# Altium project Gen_Ai_Kbd.PrjPcb (part 1 of 3)
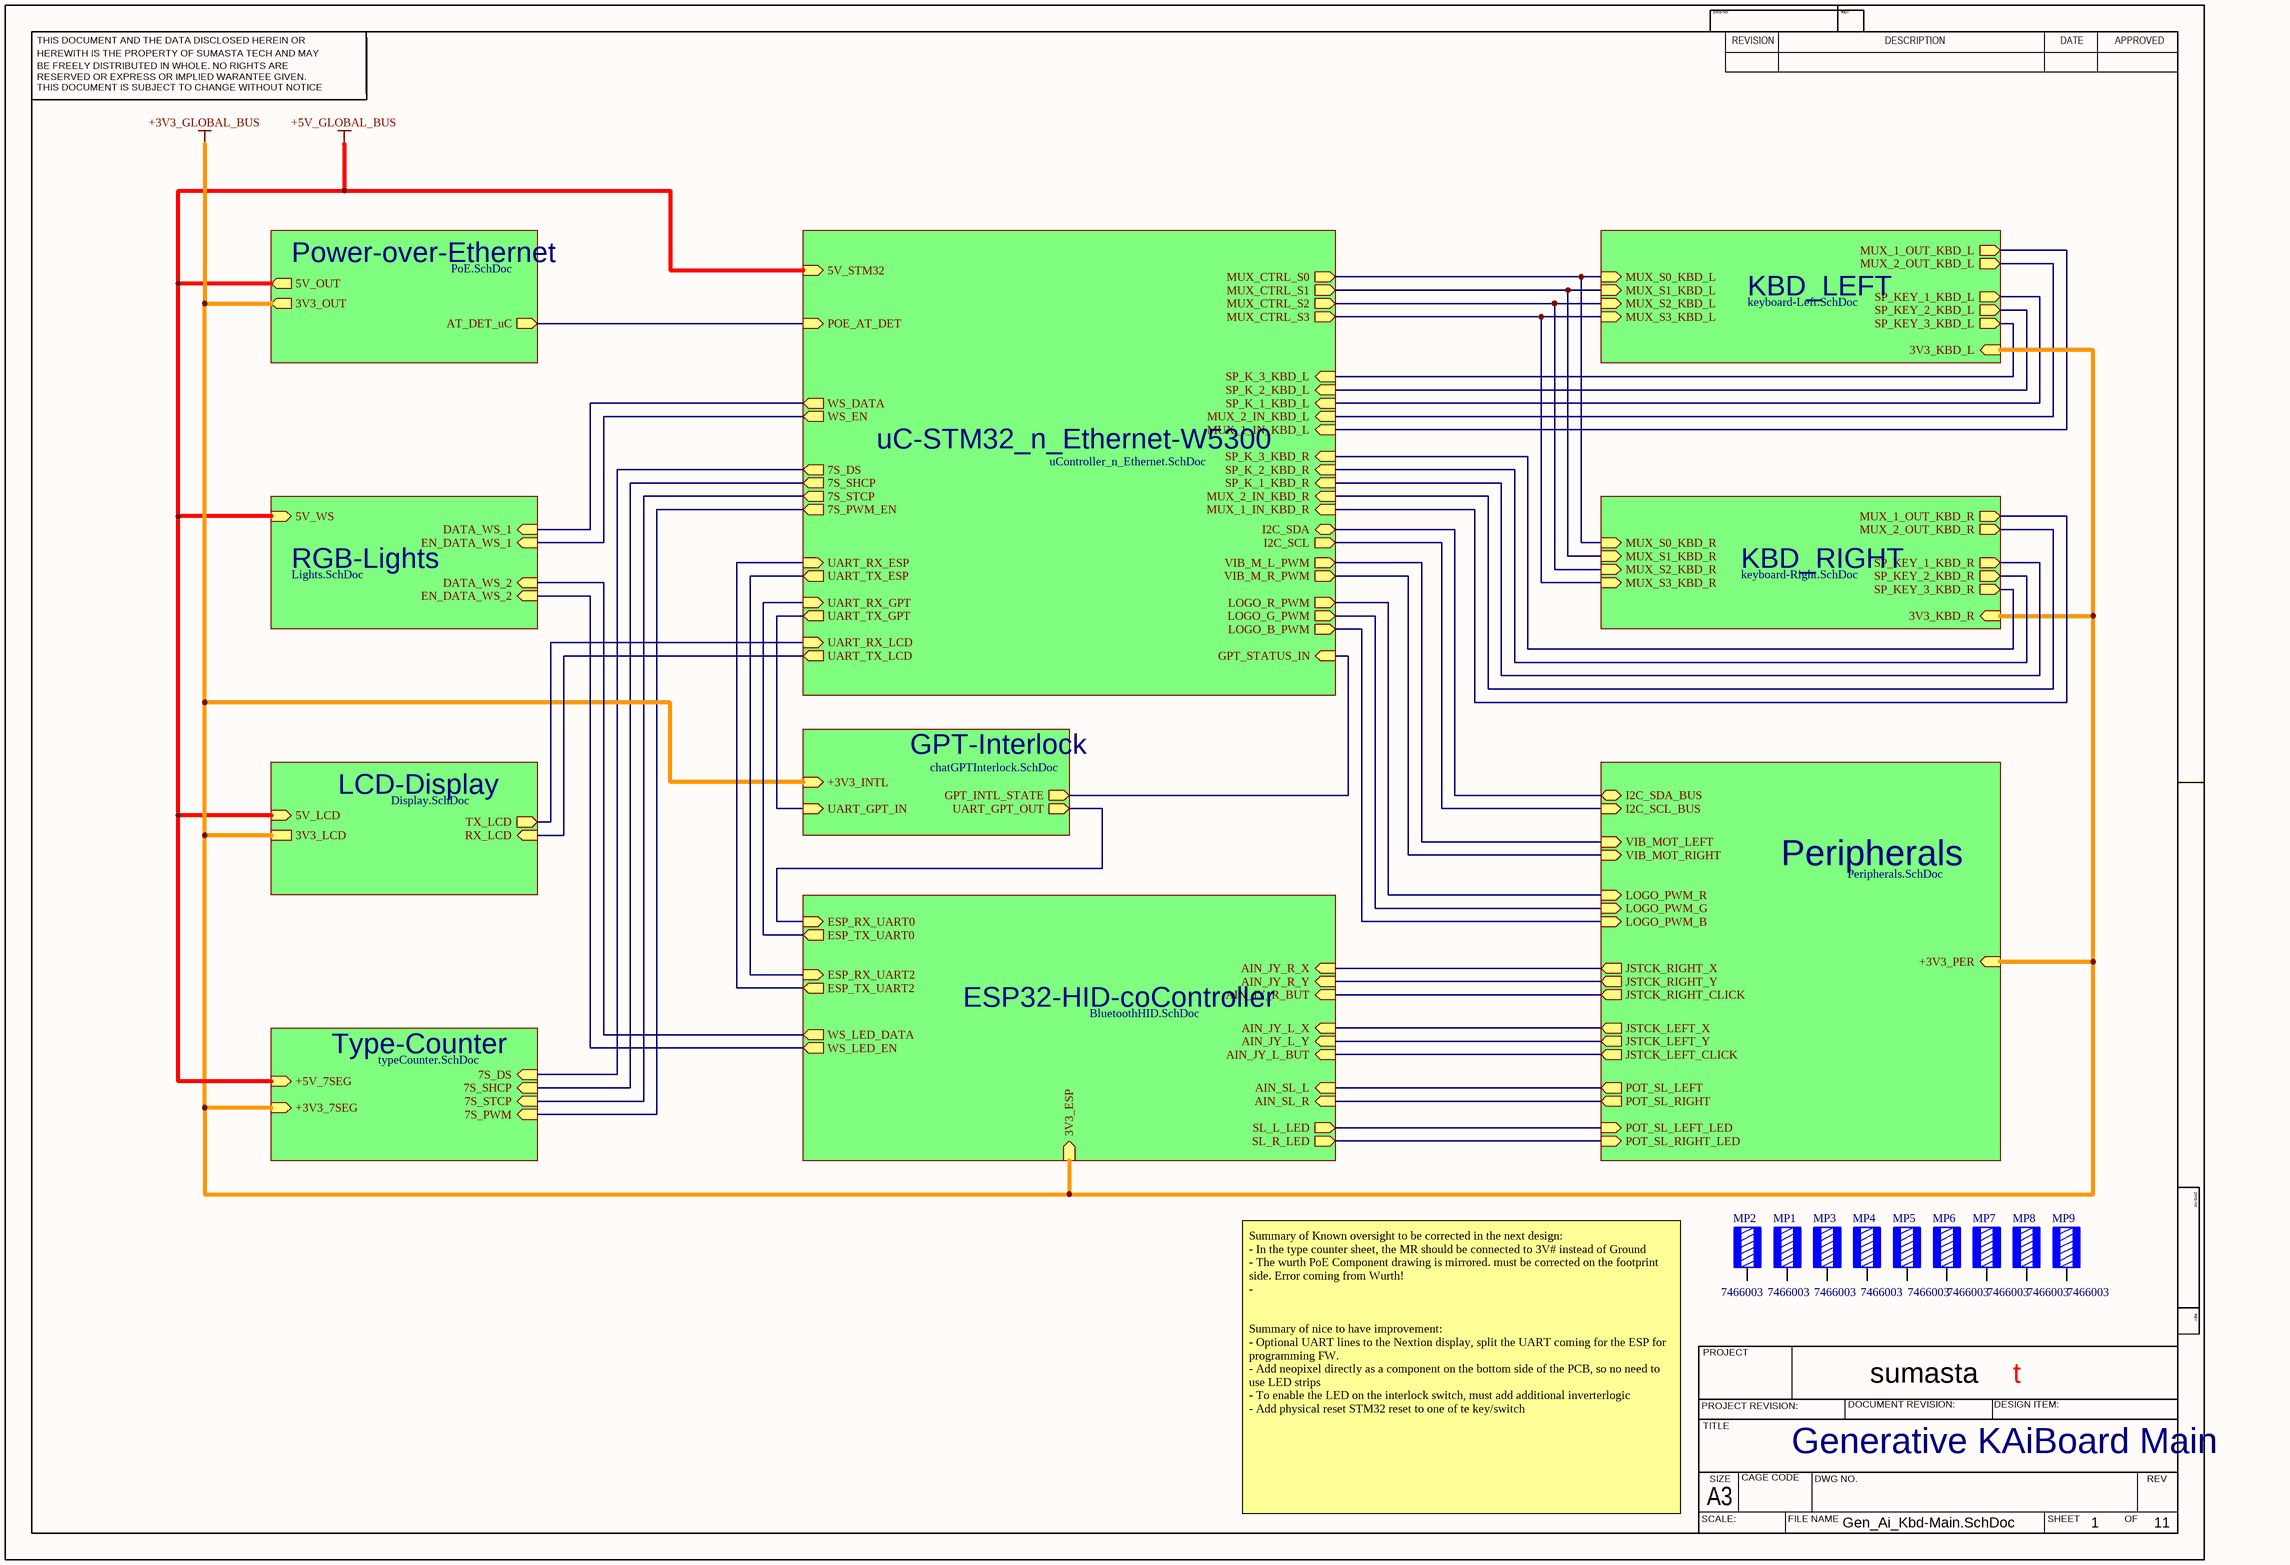
[diagram p0: Gen_Ai_Kbd-Main.SchDoc]
=CAGE: Test; =DOC_NO_BOM: Default
11 sheets, 428 parts. Net scope: hierarchical (ports join the sheet entries above them; power ports are global).
Board file: Gen_Ai_Kbd.PcbDoc
Sheets:
  Gen_Ai_Kbd-Main.SchDoc
    KBD_LEFT = keyboard-Left.SchDoc
    KBD_RIGHT = keyboard-Right.SchDoc
    Power-over-Ethernet = PoE.SchDoc
    RGB-Lights = Lights.SchDoc
    LCD-Display = Display.SchDoc
    Peripherals = Peripherals.SchDoc
    uC-STM32_n_Ethernet-W5300 = uController_n_Ethernet.SchDoc
    ESP32-HID-coController = BluetoothHID.SchDoc
    Type-Counter = typeCounter.SchDoc
    GPT-Interlock = chatGPTInterlock.SchDoc

## Sheet Gen_Ai_Kbd-Main.SchDoc
size 420 x 297 mm; SheetNumber: 1; SheetTotal: 11

### Parts
MP1  7466003  [7466003]
MP2  7466003  [7466003]
MP3  7466003  [7466003]
MP4  7466003  [7466003]
MP5  7466003  [7466003]
MP6  7466003  [7466003]
MP7  7466003  [7466003]
MP8  7466003  [7466003]
MP9  7466003  [7466003]

### Sub-sheets
ESP32-HID-coController = BluetoothHID.SchDoc: 3V3_ESP (in), AIN_JY_L_X (in), AIN_JY_L_Y (in), AIN_JY_R_X (in), AIN_JY_R_Y (in), AIN_SL_R (in), AIN_SL_L (in), AIN_JY_L_BUT (in), AIN_JY_R_BUT (in), ESP_RX_UART2 (in), ESP_TX_UART2 (out), SL_R_LED (out), SL_L_LED (out), ESP_RX_UART0 (in), ESP_TX_UART0 (out), WS_LED_DATA (out), WS_LED_EN (out)
GPT-Interlock = chatGPTInterlock.SchDoc: +3V3_INTL (in), UART_GPT_IN (in), UART_GPT_OUT (out), GPT_INTL_STATE (out)
KBD_LEFT = keyboard-Left.SchDoc: MUX_S0_KBD_L (in), MUX_S1_KBD_L (in), MUX_S2_KBD_L (in), MUX_S3_KBD_L (in), 3V3_KBD_L (in), MUX_1_OUT_KBD_L (out), MUX_2_OUT_KBD_L (out), SP_KEY_1_KBD_L (out), SP_KEY_2_KBD_L (out), SP_KEY_3_KBD_L (out)
KBD_RIGHT = keyboard-Right.SchDoc: MUX_S0_KBD_R (in), MUX_S1_KBD_R (in), MUX_S2_KBD_R (in), MUX_S3_KBD_R (in), 3V3_KBD_R (in), MUX_1_OUT_KBD_R (out), MUX_2_OUT_KBD_R (out), SP_KEY_1_KBD_R (out), SP_KEY_2_KBD_R (out), SP_KEY_3_KBD_R (out)
LCD-Display = Display.SchDoc: 5V_LCD (in), TX_LCD (out), RX_LCD (in), 3V3_LCD
Peripherals = Peripherals.SchDoc: +3V3_PER (in), JSTCK_LEFT_X (out), JSTCK_LEFT_Y (out), JSTCK_LEFT_CLICK (out), JSTCK_RIGHT_X (out), JSTCK_RIGHT_Y (out), JSTCK_RIGHT_CLICK (out), LOGO_PWM_R (in), LOGO_PWM_G (in), LOGO_PWM_B (in), I2C_SDA_BUS (bidir), I2C_SCL_BUS (in), POT_SL_LEFT (out), POT_SL_RIGHT (out), POT_SL_LEFT_LED (in), POT_SL_RIGHT_LED (in), VIB_MOT_LEFT (in), VIB_MOT_RIGHT (in)
Power-over-Ethernet = PoE.SchDoc: AT_DET_uC (out), 5V_OUT (out), 3V3_OUT (out)
RGB-Lights = Lights.SchDoc: 5V_WS (in), DATA_WS_1 (in), DATA_WS_2 (in), EN_DATA_WS_1 (in), EN_DATA_WS_2 (in)
Type-Counter = typeCounter.SchDoc: +5V_7SEG (in), +3V3_7SEG (in), 7S_DS (in), 7S_SHCP (in), 7S_STCP (in), 7S_PWM (in)
uC-STM32_n_Ethernet-W5300 = uController_n_Ethernet.SchDoc: I2C_SCL (out), I2C_SDA (bidir), LOGO_R_PWM (out), LOGO_G_PWM (out), LOGO_B_PWM (out), VIB_M_L_PWM (out), VIB_M_R_PWM (out), MUX_1_IN_KBD_R (in), MUX_CTRL_S0 (out), MUX_CTRL_S1 (out), MUX_CTRL_S2 (out), MUX_CTRL_S3 (out), SP_K_1_KBD_L (in), SP_K_2_KBD_L (in), SP_K_3_KBD_L (in), SP_K_1_KBD_R (in), SP_K_2_KBD_R (in), SP_K_3_KBD_R (in), 7S_DS (out), 7S_SHCP (out), 7S_STCP (out), 7S_PWM_EN (out), POE_AT_DET (in), UART_TX_LCD (out), UART_RX_LCD (in), UART_RX_GPT (in), UART_TX_GPT (out), UART_TX_ESP (out), UART_RX_ESP (in), WS_DATA (out), WS_EN (out), 5V_STM32 (in), GPT_STATUS_IN (in), MUX_2_IN_KBD_L (in), MUX_1_IN_KBD_L (in), MUX_2_IN_KBD_R (in)

### Nets
+3V3_GLOBAL_BUS: sheet KBD_LEFT/3V3_KBD_L, sheet KBD_RIGHT/3V3_KBD_R, sheet Power-over-Ethernet/3V3_OUT, sheet LCD-Display/3V3_LCD, sheet Peripherals/+3V3_PER, sheet ESP32-HID-coController/3V3_ESP, sheet Type-Counter/+3V3_7SEG, sheet GPT-Interlock/+3V3_INTL
+5V_GLOBAL_BUS: sheet Power-over-Ethernet/5V_OUT, sheet RGB-Lights/5V_WS, sheet LCD-Display/5V_LCD, sheet uC-STM32_n_Ethernet-W5300/5V_STM32, sheet Type-Counter/+5V_7SEG
I2C1_SCL: sheet Peripherals/I2C_SCL_BUS, sheet uC-STM32_n_Ethernet-W5300/I2C_SCL
I2C1_SDA: sheet Peripherals/I2C_SDA_BUS, sheet uC-STM32_n_Ethernet-W5300/I2C_SDA
PA0: sheet Peripherals/LOGO_PWM_R, sheet uC-STM32_n_Ethernet-W5300/LOGO_R_PWM
PA1: sheet Peripherals/LOGO_PWM_G, sheet uC-STM32_n_Ethernet-W5300/LOGO_G_PWM
PA2: sheet uC-STM32_n_Ethernet-W5300/UART_TX_ESP, sheet ESP32-HID-coController/ESP_RX_UART2
PA3: sheet uC-STM32_n_Ethernet-W5300/UART_RX_ESP, sheet ESP32-HID-coController/ESP_TX_UART2
PA4: sheet uC-STM32_n_Ethernet-W5300/GPT_STATUS_IN, sheet GPT-Interlock/GPT_INTL_STATE
PA15: sheet Peripherals/LOGO_PWM_B, sheet uC-STM32_n_Ethernet-W5300/LOGO_B_PWM
PB0: sheet uC-STM32_n_Ethernet-W5300/7S_PWM_EN, sheet Type-Counter/7S_PWM
PB1: sheet KBD_LEFT/SP_KEY_1_KBD_L, sheet uC-STM32_n_Ethernet-W5300/SP_K_1_KBD_L
PB2: sheet KBD_LEFT/SP_KEY_3_KBD_L, sheet uC-STM32_n_Ethernet-W5300/SP_K_3_KBD_L
PB3: sheet uC-STM32_n_Ethernet-W5300/7S_STCP, sheet Type-Counter/7S_STCP
PB4: sheet uC-STM32_n_Ethernet-W5300/7S_DS, sheet Type-Counter/7S_DS
PB5: sheet uC-STM32_n_Ethernet-W5300/7S_SHCP, sheet Type-Counter/7S_SHCP
PB6: sheet KBD_RIGHT/SP_KEY_1_KBD_R, sheet uC-STM32_n_Ethernet-W5300/SP_K_1_KBD_R
PB11: sheet KBD_RIGHT/SP_KEY_3_KBD_R, sheet uC-STM32_n_Ethernet-W5300/SP_K_3_KBD_R
PC0: sheet KBD_RIGHT/MUX_1_OUT_KBD_R, sheet uC-STM32_n_Ethernet-W5300/MUX_1_IN_KBD_R
PC2: sheet KBD_LEFT/MUX_1_OUT_KBD_L, sheet uC-STM32_n_Ethernet-W5300/MUX_1_IN_KBD_L
PC3: sheet KBD_LEFT/MUX_2_OUT_KBD_L, sheet uC-STM32_n_Ethernet-W5300/MUX_2_IN_KBD_L
PC4: sheet KBD_RIGHT/MUX_2_OUT_KBD_R, sheet uC-STM32_n_Ethernet-W5300/MUX_2_IN_KBD_R
PC6: sheet Peripherals/VIB_MOT_RIGHT, sheet uC-STM32_n_Ethernet-W5300/VIB_M_R_PWM
PC7: sheet Peripherals/VIB_MOT_LEFT, sheet uC-STM32_n_Ethernet-W5300/VIB_M_L_PWM
PC10: sheet uC-STM32_n_Ethernet-W5300/UART_TX_GPT, sheet GPT-Interlock/UART_GPT_IN
PD3: sheet RGB-Lights/DATA_WS_1, sheet uC-STM32_n_Ethernet-W5300/WS_DATA
PD6: sheet uC-STM32_n_Ethernet-W5300/UART_RX_GPT, sheet ESP32-HID-coController/ESP_TX_UART0
PD11: sheet KBD_LEFT/MUX_S2_KBD_L, sheet KBD_RIGHT/MUX_S2_KBD_R, sheet uC-STM32_n_Ethernet-W5300/MUX_CTRL_S2
PD12: sheet KBD_LEFT/MUX_S1_KBD_L, sheet KBD_RIGHT/MUX_S1_KBD_R, sheet uC-STM32_n_Ethernet-W5300/MUX_CTRL_S1
PD13: sheet KBD_LEFT/MUX_S0_KBD_L, sheet KBD_RIGHT/MUX_S0_KBD_R, sheet uC-STM32_n_Ethernet-W5300/MUX_CTRL_S0
PE0: sheet KBD_RIGHT/SP_KEY_2_KBD_R, sheet uC-STM32_n_Ethernet-W5300/SP_K_2_KBD_R
PF7: sheet Power-over-Ethernet/AT_DET_uC, sheet uC-STM32_n_Ethernet-W5300/POE_AT_DET
PF9: sheet KBD_LEFT/SP_KEY_2_KBD_L, sheet uC-STM32_n_Ethernet-W5300/SP_K_2_KBD_L
PG0: sheet KBD_LEFT/MUX_S3_KBD_L, sheet KBD_RIGHT/MUX_S3_KBD_R, sheet uC-STM32_n_Ethernet-W5300/MUX_CTRL_S3
PG2: sheet RGB-Lights/EN_DATA_WS_1, sheet uC-STM32_n_Ethernet-W5300/WS_EN
PG9: sheet LCD-Display/TX_LCD, sheet uC-STM32_n_Ethernet-W5300/UART_RX_LCD
PG14: sheet LCD-Display/RX_LCD, sheet uC-STM32_n_Ethernet-W5300/UART_TX_LCD
RXD_ESP: sheet ESP32-HID-coController/ESP_RX_UART0, sheet GPT-Interlock/UART_GPT_OUT
NetC51_1: sheet Peripherals/JSTCK_LEFT_X, sheet ESP32-HID-coController/AIN_JY_L_X
NetC52_1: sheet Peripherals/JSTCK_LEFT_Y, sheet ESP32-HID-coController/AIN_JY_L_Y
NetC53_1: sheet Peripherals/JSTCK_RIGHT_X, sheet ESP32-HID-coController/AIN_JY_R_X
NetC54_1: sheet Peripherals/JSTCK_RIGHT_Y, sheet ESP32-HID-coController/AIN_JY_R_Y
NetC71_1: sheet Peripherals/POT_SL_LEFT, sheet ESP32-HID-coController/AIN_SL_L
NetC72_1: sheet Peripherals/POT_SL_RIGHT, sheet ESP32-HID-coController/AIN_SL_R
NetMD1_7: sheet Peripherals/JSTCK_RIGHT_CLICK, sheet ESP32-HID-coController/AIN_JY_R_BUT
NetMD1_16: sheet RGB-Lights/DATA_WS_2, sheet ESP32-HID-coController/WS_LED_DATA
NetMD1_26: sheet Peripherals/JSTCK_LEFT_CLICK, sheet ESP32-HID-coController/AIN_JY_L_BUT
NetMD1_33: sheet RGB-Lights/EN_DATA_WS_2, sheet ESP32-HID-coController/WS_LED_EN
NetMD1_36: sheet Peripherals/POT_SL_RIGHT_LED, sheet ESP32-HID-coController/SL_R_LED
NetMD1_37: sheet Peripherals/POT_SL_LEFT_LED, sheet ESP32-HID-coController/SL_L_LED

Not connected (* = marked no-connect by the designer): MP1 1; MP2 1; MP3 1; MP4 1; MP5 1; MP6 1; MP7 1; MP8 1; MP9 1

### Notes on the sheet
- Summary of Known oversight to be corrected in the next design:
  - In the type counter sheet, the MR should be connected to 3V# instead of Ground
  - The wurth PoE Component drawing is mirrored. must be corrected on the footprint side. Error coming from Wurth!
  -
  Summary of nice to have improvement:
  - Optional UART lines to the Nextion display, split the UART coming for the ESP for programming FW.
  - Add neopixel directly as a component on the bottom side of the PCB, so no need to use LED strips
  - To enable the LED on the interlock switch, must add additional inverterlogic
  - Add physical reset STM32 reset to one of te key/switch
- Generative KAiBoard Main
- THIS DOCUMENT AND THE DATA DISCLOSED HEREIN OR
- HEREWITH IS THE PROPERTY OF SUMASTA TECH AND MAY
- DWG NO:
- REVISION
- REV:
- DESCRIPTION
- DATE
- APPROVED
- BE FREELY DISTRIBUTED IN WHOLE. NO RIGHTS ARE
- THIS DOCUMENT IS SUBJECT TO CHANGE WITHOUT NOTICE
- RESERVED OR EXPRESS OR IMPLIED WARANTEE GIVEN.
- PROJECT
- sumasta
- t
- PROJECT REVISION:
- TITLE
- DOCUMENT REVISION:
- DESIGN ITEM:
- SCALE:
- A3
- SIZE
- CAGE CODE
- FILE NAME
- DWG NO.
- SHEET
- OF
- REV

### Library data of the parts
MP1-MP9 = CMP-03913-34964368-1: 7466003 WP-SMBU REDCUBE Bush, SMT_open; Current Rating: 50A; Thread Size: M3; Number of Contacts: 1; Number of Pins: 1; RoHS: Compliant; Material: Brass; Mount: Surface Mount; Contact Plating: Tin; Min Operating Temperature: -55°C; REACH SVHC: Unknown; Max Operating Temperature: 150°C; Termination: Power; Contact Material: Brass; Length: 7mm; Height: 5mm; Packaging: Bulk; NexarPartId: 34964368

## Sheet keyboard-Left.SchDoc
size 420 x 297 mm; SheetNumber: 2; SheetTotal: 11; SPICEModelCacheCUGXHSME: <root> / <DocumentId>CUGXHSME</DocumentId> / <CacheFrame Number="0"> / <Model Name="0603_885012206020_100nf" Kind="CKT"> / <Text>******* / .subckt 0603_885012206020_100nF 1 2 / Rser 1 3 0.0188883213835 / Lser 2 4 4.53593763E-10 / C1 3 4 0.0000001 / Rpar 3 4 5000000000 / .ends 0603_885012206020_100nF</Text> / </Model> / </CacheFrame> / </root>
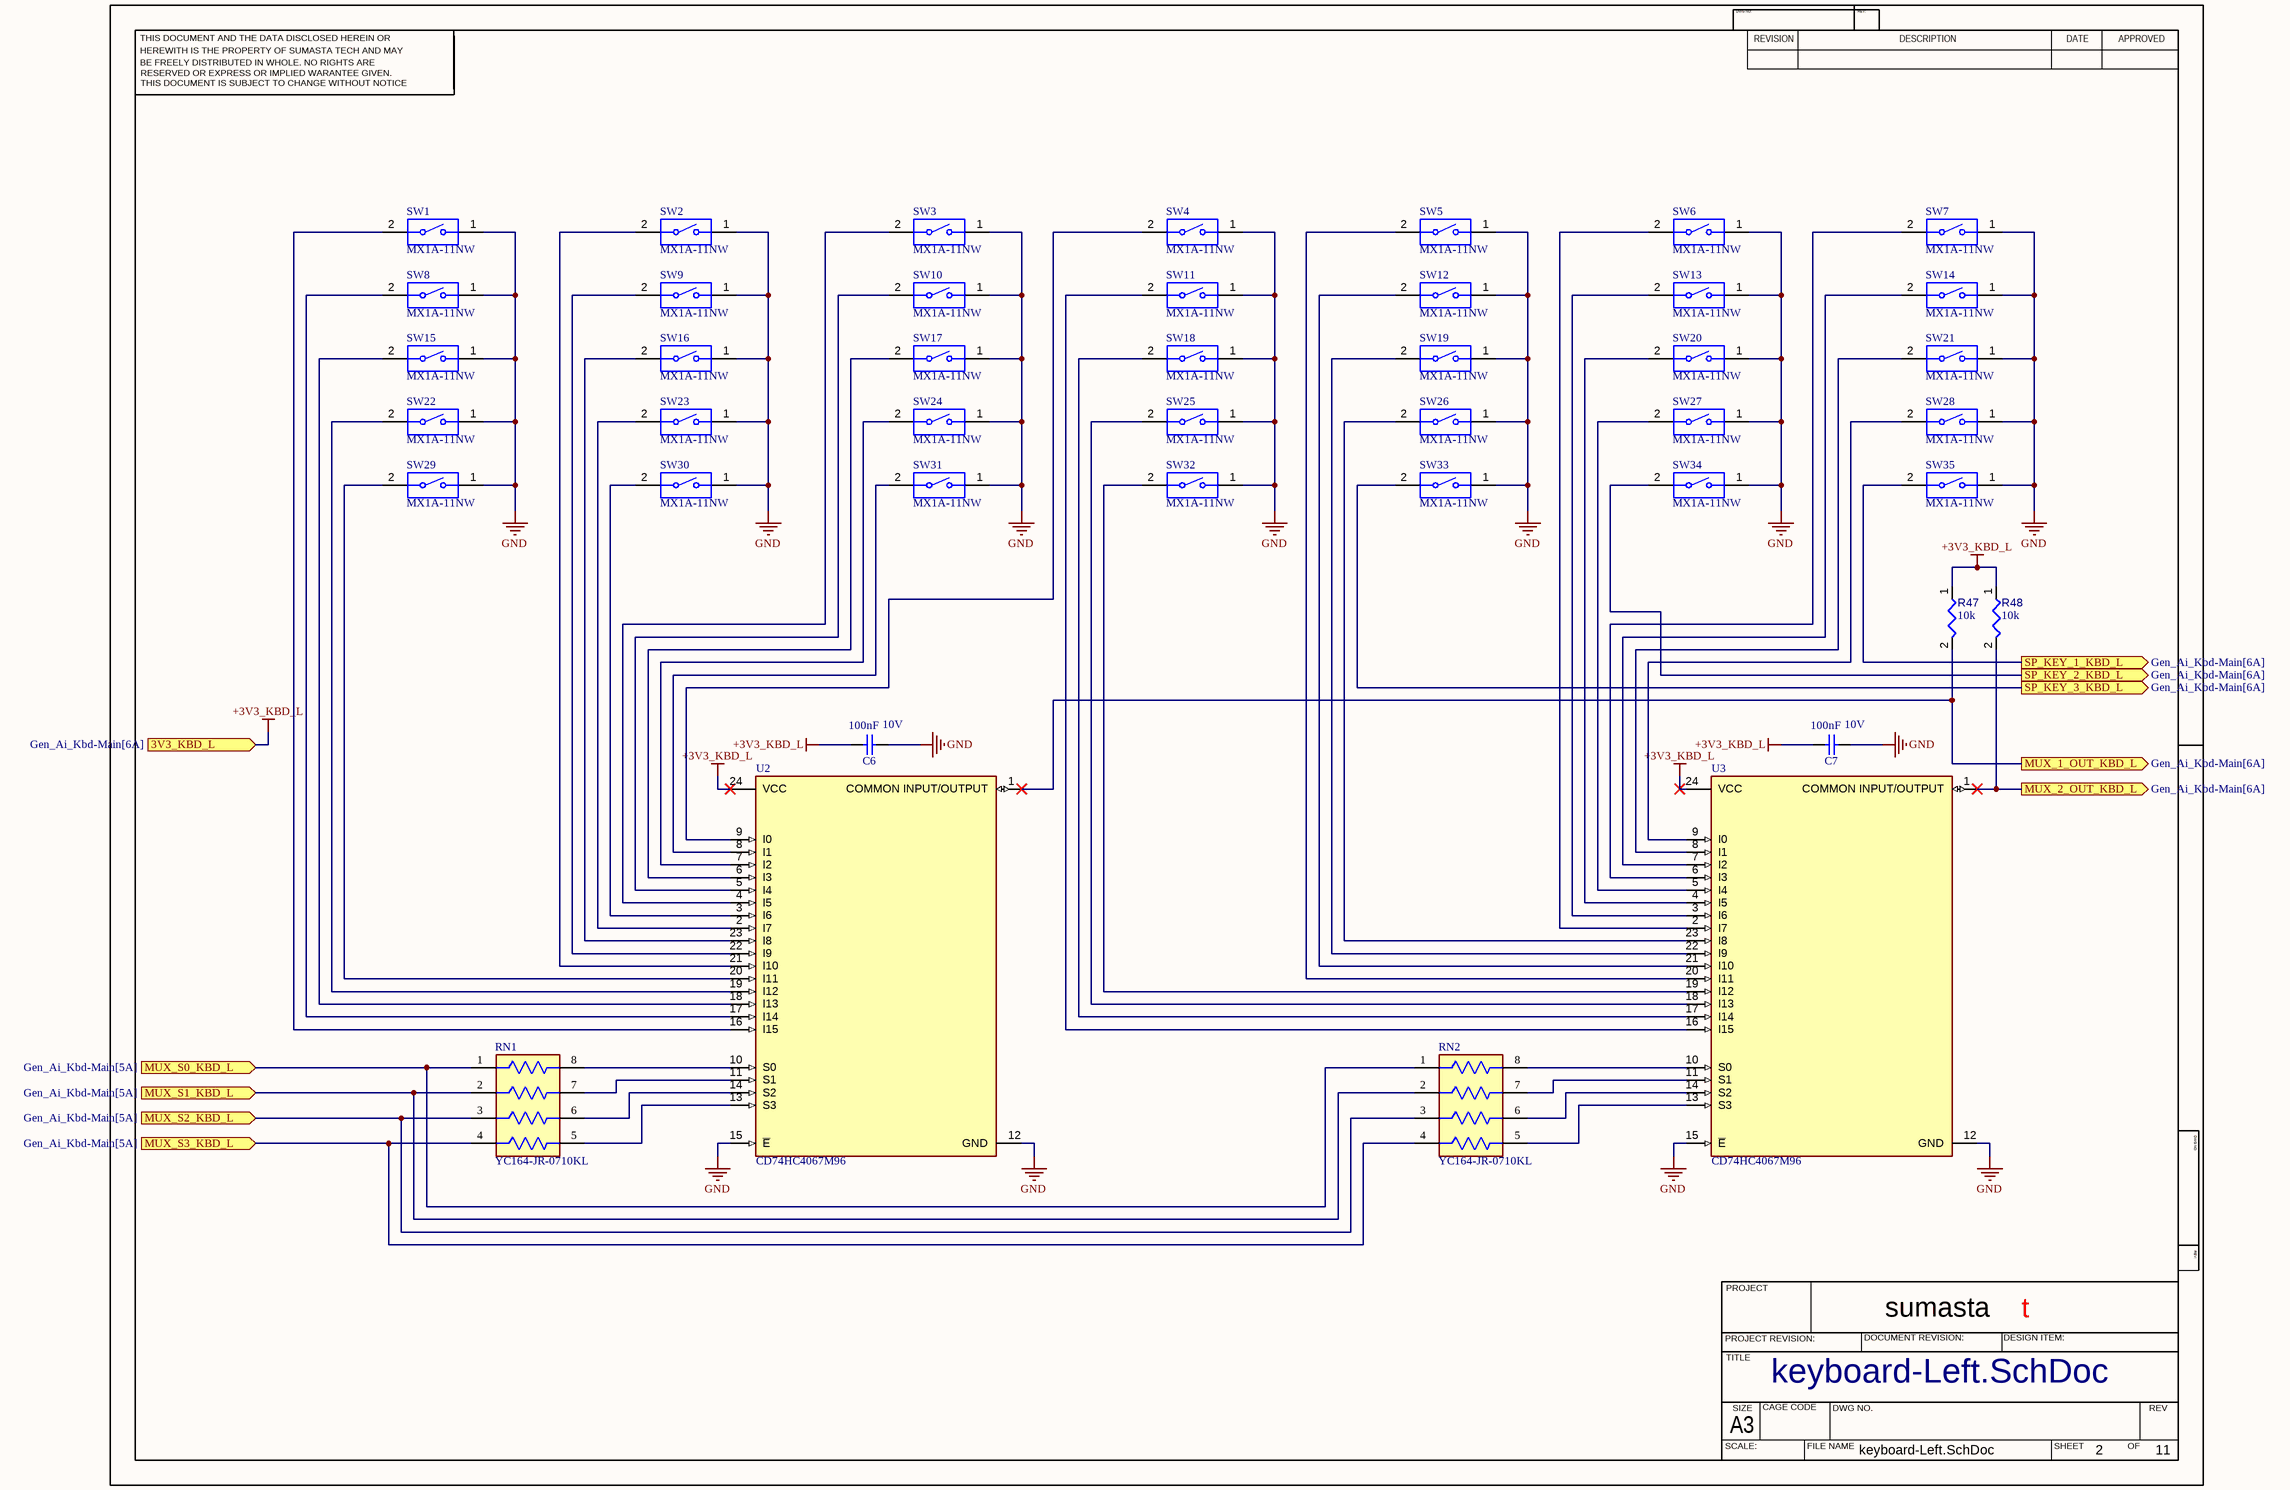
[diagram p1: keyboard-Left.SchDoc]

### Parts
C6  Rated Voltage (DC): 10V  Capacitance: 100nF  [WCAP-CSGP_0603_L1.6W0.8H0.8_Reflow]  (hidden comment: 885012206020)
C7  Rated Voltage (DC): 10V  Capacitance: 100nF  [WCAP-CSGP_0603_L1.6W0.8H0.8_Reflow]  (hidden comment: 885012206020)
R47  value 10k  [RESC1608X55X25ML10T15]  (hidden comment: Resistor 10k +/-1% 0603 100 mW)
R48  value 10k  [RESC1608X55X25ML10T15]  (hidden comment: Resistor 10k +/-1% 0603 100 mW)
RN1  YC164-JR-0710KL  [FP-YC164-MFG]
RN2  YC164-JR-0710KL  [FP-YC164-MFG]
SW1  MX1A-11NW  [CHRY-MX1A-11NW_V]
SW2  MX1A-11NW  [CHRY-MX1A-11NW_V]
SW3  MX1A-11NW  [CHRY-MX1A-11NW_V]
SW4  MX1A-11NW  [CHRY-MX1A-11NW_V]
SW5  MX1A-11NW  [CHRY-MX1A-11NW_V]
SW6  MX1A-11NW  [CHRY-MX1A-11NW_V]
SW7  MX1A-11NW  [CHRY-MX1A-11NW_V]
SW8  MX1A-11NW  [CHRY-MX1A-11NW_V]
SW9  MX1A-11NW  [CHRY-MX1A-11NW_V]
SW10  MX1A-11NW  [CHRY-MX1A-11NW_V]
SW11  MX1A-11NW  [CHRY-MX1A-11NW_V]
SW12  MX1A-11NW  [CHRY-MX1A-11NW_V]
SW13  MX1A-11NW  [CHRY-MX1A-11NW_V]
SW14  MX1A-11NW  [CHRY-MX1A-11NW_V]
SW15  MX1A-11NW  [CHRY-MX1A-11NW_V]
SW16  MX1A-11NW  [CHRY-MX1A-11NW_V]
SW17  MX1A-11NW  [CHRY-MX1A-11NW_V]
SW18  MX1A-11NW  [CHRY-MX1A-11NW_V]
SW19  MX1A-11NW  [CHRY-MX1A-11NW_V]
SW20  MX1A-11NW  [CHRY-MX1A-11NW_V]
SW21  MX1A-11NW  [CHRY-MX1A-11NW_V]
SW22  MX1A-11NW  [CHRY-MX1A-11NW_V]
SW23  MX1A-11NW  [CHRY-MX1A-11NW_V]
SW24  MX1A-11NW  [CHRY-MX1A-11NW_V]
SW25  MX1A-11NW  [CHRY-MX1A-11NW_V]
SW26  MX1A-11NW  [CHRY-MX1A-11NW_V]
SW27  MX1A-11NW  [CHRY-MX1A-11NW_V]
SW28  MX1A-11NW  [CHRY-MX1A-11NW_V]
SW29  MX1A-11NW  [CHRY-MX1A-11NW_V]
SW30  MX1A-11NW  [CHRY-MX1A-11NW_V]
SW31  MX1A-11NW  [CHRY-MX1A-11NW_V]
SW32  MX1A-11NW  [CHRY-MX1A-11NW_V]
SW33  MX1A-11NW  [CHRY-MX1A-11NW_V]
SW34  MX1A-11NW  [CHRY-MX1A-11NW_V]
SW35  MX1A-11NW  [CHRY-MX1A-11NW_V]
U2  CD74HC4067M96  [FP-DW0024A-MFG]
U3  CD74HC4067M96  [FP-DW0024A-MFG]

### Ports
3V3_KBD_L (in, see Gen_Ai_Kbd-Main[6A]), MUX_1_OUT_KBD_L (out, see Gen_Ai_Kbd-Main[6A]), MUX_2_OUT_KBD_L (out, see Gen_Ai_Kbd-Main[6A]), MUX_S0_KBD_L (in, see Gen_Ai_Kbd-Main[5A]), MUX_S1_KBD_L (in, see Gen_Ai_Kbd-Main[5A]), MUX_S2_KBD_L (in, see Gen_Ai_Kbd-Main[5A]), MUX_S3_KBD_L (in, see Gen_Ai_Kbd-Main[5A]), SP_KEY_1_KBD_L (out, see Gen_Ai_Kbd-Main[6A]), SP_KEY_2_KBD_L (out, see Gen_Ai_Kbd-Main[6A]), SP_KEY_3_KBD_L (out, see Gen_Ai_Kbd-Main[6A])

### Nets
+3V3_KBD_L: C6.1 C7.1 R47.1 R48.1 U2.24(VCC) U3.24(VCC) ; port 3V3_KBD_L  [project net +3V3_GLOBAL_BUS]
GND: C6.2 C7.2 SW1.1 SW2.1 SW3.1 SW4.1 SW5.1 SW6.1 SW7.1 SW8.1 SW9.1 SW10.1 SW11.1 SW12.1 SW13.1 SW14.1 SW15.1 SW16.1 SW17.1 SW18.1 SW19.1 SW20.1 SW21.1 SW22.1 SW23.1 SW24.1 SW25.1 SW26.1 SW27.1 SW28.1 SW29.1 SW30.1 SW31.1 SW32.1 SW33.1 SW34.1 SW35.1 U2.12(GND) U2.15(~{E}) U3.12(GND) U3.15(~{E})
PB1: SW35.2 ; port SP_KEY_1_KBD_L
PB2: SW33.2 ; port SP_KEY_3_KBD_L
PC2: R47.2 U2.1(COMMON_INPUT/OUTPUT) ; port MUX_1_OUT_KBD_L
PC3: R48.2 U3.1(COMMON_INPUT/OUTPUT) ; port MUX_2_OUT_KBD_L
PD11: RN1.3 RN2.3 ; port MUX_S2_KBD_L
PD12: RN1.2 RN2.2 ; port MUX_S1_KBD_L
PD13: RN1.1 RN2.1 ; port MUX_S0_KBD_L
PF9: SW34.2 ; port SP_KEY_2_KBD_L
PG0: RN1.4 RN2.4 ; port MUX_S3_KBD_L
NetRN1_5: RN1.5 U2.13(S3)
NetRN1_6: RN1.6 U2.14(S2)
NetRN1_7: RN1.7 U2.11(S1)
NetRN1_8: RN1.8 U2.10(S0)
NetRN2_5: RN2.5 U3.13(S3)
NetRN2_6: RN2.6 U3.14(S2)
NetRN2_7: RN2.7 U3.11(S1)
NetRN2_8: RN2.8 U3.10(S0)
NetSW1_2: SW1.2 U2.16(I15)
NetSW2_2: SW2.2 U2.21(I10)
NetSW3_2: SW3.2 U2.4(I5)
NetSW4_2: SW4.2 U2.9(I0)
NetSW5_2: SW5.2 U3.20(I11)
NetSW6_2: SW6.2 U3.2(I7)
NetSW7_2: SW7.2 U3.6(I3)
NetSW8_2: SW8.2 U2.17(I14)
NetSW9_2: SW9.2 U2.22(I9)
NetSW10_2: SW10.2 U2.5(I4)
NetSW11_2: SW11.2 U3.16(I15)
NetSW12_2: SW12.2 U3.21(I10)
NetSW13_2: SW13.2 U3.3(I6)
NetSW14_2: SW14.2 U3.7(I2)
NetSW15_2: SW15.2 U2.18(I13)
NetSW16_2: SW16.2 U2.23(I8)
NetSW17_2: SW17.2 U2.6(I3)
NetSW18_2: SW18.2 U3.17(I14)
NetSW19_2: SW19.2 U3.22(I9)
NetSW20_2: SW20.2 U3.4(I5)
NetSW21_2: SW21.2 U3.8(I1)
NetSW22_2: SW22.2 U2.19(I12)
NetSW23_2: SW23.2 U2.2(I7)
NetSW24_2: SW24.2 U2.7(I2)
NetSW25_2: SW25.2 U3.18(I13)
NetSW26_2: SW26.2 U3.23(I8)
NetSW27_2: SW27.2 U3.5(I4)
NetSW28_2: SW28.2 U3.9(I0)
NetSW29_2: SW29.2 U2.20(I11)
NetSW30_2: SW30.2 U2.3(I6)
NetSW31_2: SW31.2 U2.8(I1)
NetSW32_2: SW32.2 U3.19(I12)

### Notes on the sheet
- THIS DOCUMENT AND THE DATA DISCLOSED HEREIN OR
- HEREWITH IS THE PROPERTY OF SUMASTA TECH AND MAY
- DWG NO:
- REVISION
- REV:
- DESCRIPTION
- DATE
- APPROVED
- BE FREELY DISTRIBUTED IN WHOLE. NO RIGHTS ARE
- THIS DOCUMENT IS SUBJECT TO CHANGE WITHOUT NOTICE
- RESERVED OR EXPRESS OR IMPLIED WARANTEE GIVEN.
- PROJECT
- sumasta
- t
- PROJECT REVISION:
- TITLE
- DOCUMENT REVISION:
- DESIGN ITEM:
- SCALE:
- A3
- SIZE
- CAGE CODE
- FILE NAME
- DWG NO.
- SHEET
- OF
- REV

### Library data of the parts
C6 C7 = CMP-007-000576-1: WCAP-CSGP Multilayer Ceramic Chip Capacitor, General Purpose, size 0603, X7R, 100nF, 10VDC; Manufacturer: Wurth Elektronik; Case/Size Code: 0603; Capacitance Tolerance: +/-10%; Technical Reference: X7R0603104K010DFCT10000; Insulation Resistance: 5GO; Dissipation Factor: 5%; Operating Temperature Min: -55°C; Packaging: Tape and Reel; Manufacturer Part Number: 885012206020; Source: WCAP-CSGP.SchLib; ComponentLink1Description: Website Link; Ceramic Type: X7R; Component Type: Standard; Height: 0.8mm; ComponentLink2URL: https://www.we-online.com/redexpert/spec/885012206020?ad; Mount: Surface Mount; Length: 1.6mm; Pin Count: 2; Design Item ID: 885012206020; ComponentLink1URL: https://www.we-online.com/redexpert/article/885012206020?ad; Width: 0.8mm; Operating Temperature Max: 125°C; Category: Multilayer Ceramic Chip Capacitors; Match Code: WCAP-CSGP; ComponentLink2Description: Datasheet Link
R47 R48 = CMP-009-00017-5: Chip Resistor, 10 KOhm, +/- 1%, 01 W, -55 to 155 degC, 0603 (1608 Metric); Voltage Rating: 50V; Power: 100mW; RoHS Compliant: True; Min Operating Temperature: -55°C; Pins: 2; Case/Package: 0603; Mounting Technology: SM; Max Operating Temperature: 155°C; Tolerance: 1%
RN1 RN2 = CMP-03411-000003-1: RES ARRAY 4 RES 10K OHM 1206; Resistance Tolerance: 5%; Power Per Element: 62.5mW; Number of Circuits: 4; Number of Terminals/Pins: 8; Voltage Rating: 50V; Resistance: 10kR; Circuit Type: Isolated; Tolerance: 1%; Temperature Coefficient: 200ppm/°C; Depth: 1.6mm; Termination: SMD/SMT; Technology: THICK FILM; Lead Free: Lead Free; Min Operating Temperature: -55°C; Number of Elements: 4; Series: YC164; Radiation Hardening: No; Length: 0.126inch; Width: 0.063inch; Case Code (Metric): 3216; Number of Pins: 8; Package Quantity: 5000; Number of Contacts: 8; Working Voltage: 50V; Packaging: Tape and Reel; Height: 0.028inch; Mount: Surface Mount; Number of Resistors: 4; Case Code (Imperial): 1206; Size Code: 0603; Terminal Pitch: 0.8mm; Military Standard: Not; Power Dissipation: 62.5mW; Case/Package: 0164; RoHS Compliant: Yes; Max Operating Temperature: 155°C
SW1-SW35 = CMP-011-00013-1: Switch Key N.O. SPST 0.01A 12VAC 12VDC 0.58N PC Pins 50000000Cycles Thru-Hole
U2 U3 = CMP-04901-000007-1: IC MUX/DEMUX 1X16 24SOIC; Manufacturer: Texas Instruments; Standoff Height: 0.1mm; Logic Function Desc: Non-Inverting; Max Supply Voltage: 6V; Number Of Inputs: 16; Quiescent Current: 8uA; Number Of Circuits: 1; Propagation Delay: 6ns; Max Junction Temp: +150°C; Min Supply Voltage: 2V; ComponentLink2Description: Datasheet; Octopart: https://octopart.com/cd74hc4067m96-texas+instruments-722802; Ambient Temperature Range High: +125°C; Ipc Land Pattern Name: SOIC127P1030X265-24; Height: 2.65mm; Mouser Description: Multiplexer Switch ICs Hi-Spd CMOS 16Ch Anl Mltplxr/Demltplxr; Temperature Range Low: -55°C; Package: DW0024A; Temperature Range High: +125°C; Lead Free: Yes; ComponentLink2URL: http://www.ti.com/lit/ds/symlink/cd74hc4067.pdf; Manufacturer Part Number: CD74HC4067M96; RoHS: TRUE; Automotive: No; Device Class L1: Integrated Circuits (ICs); Digikey Description: IC MUX/DEMUX 1X16 24SOIC; Device Class L2: Logic ICs; Temperature: -55°C to +125°C; Device Class L3: Multiplexers; Category: IC; Ambient Temperature Range Low: -55°C; Number Of Outputs: 1

## Sheet keyboard-Right.SchDoc
size 420 x 297 mm; SheetNumber: 8; SheetTotal: 11; SPICEModelCacheCUGXHSME: <root> / <DocumentId>CUGXHSME</DocumentId> / <CacheFrame Number="0"> / <Model Name="0603_885012206020_100nf" Kind="CKT"> / <Text>******* / .subckt 0603_885012206020_100nF 1 2 / Rser 1 3 0.0188883213835 / Lser 2 4 4.53593763E-10 / C1 3 4 0.0000001 / Rpar 3 4 5000000000 / .ends 0603_885012206020_100nF</Text> / </Model> / </CacheFrame> / </root>
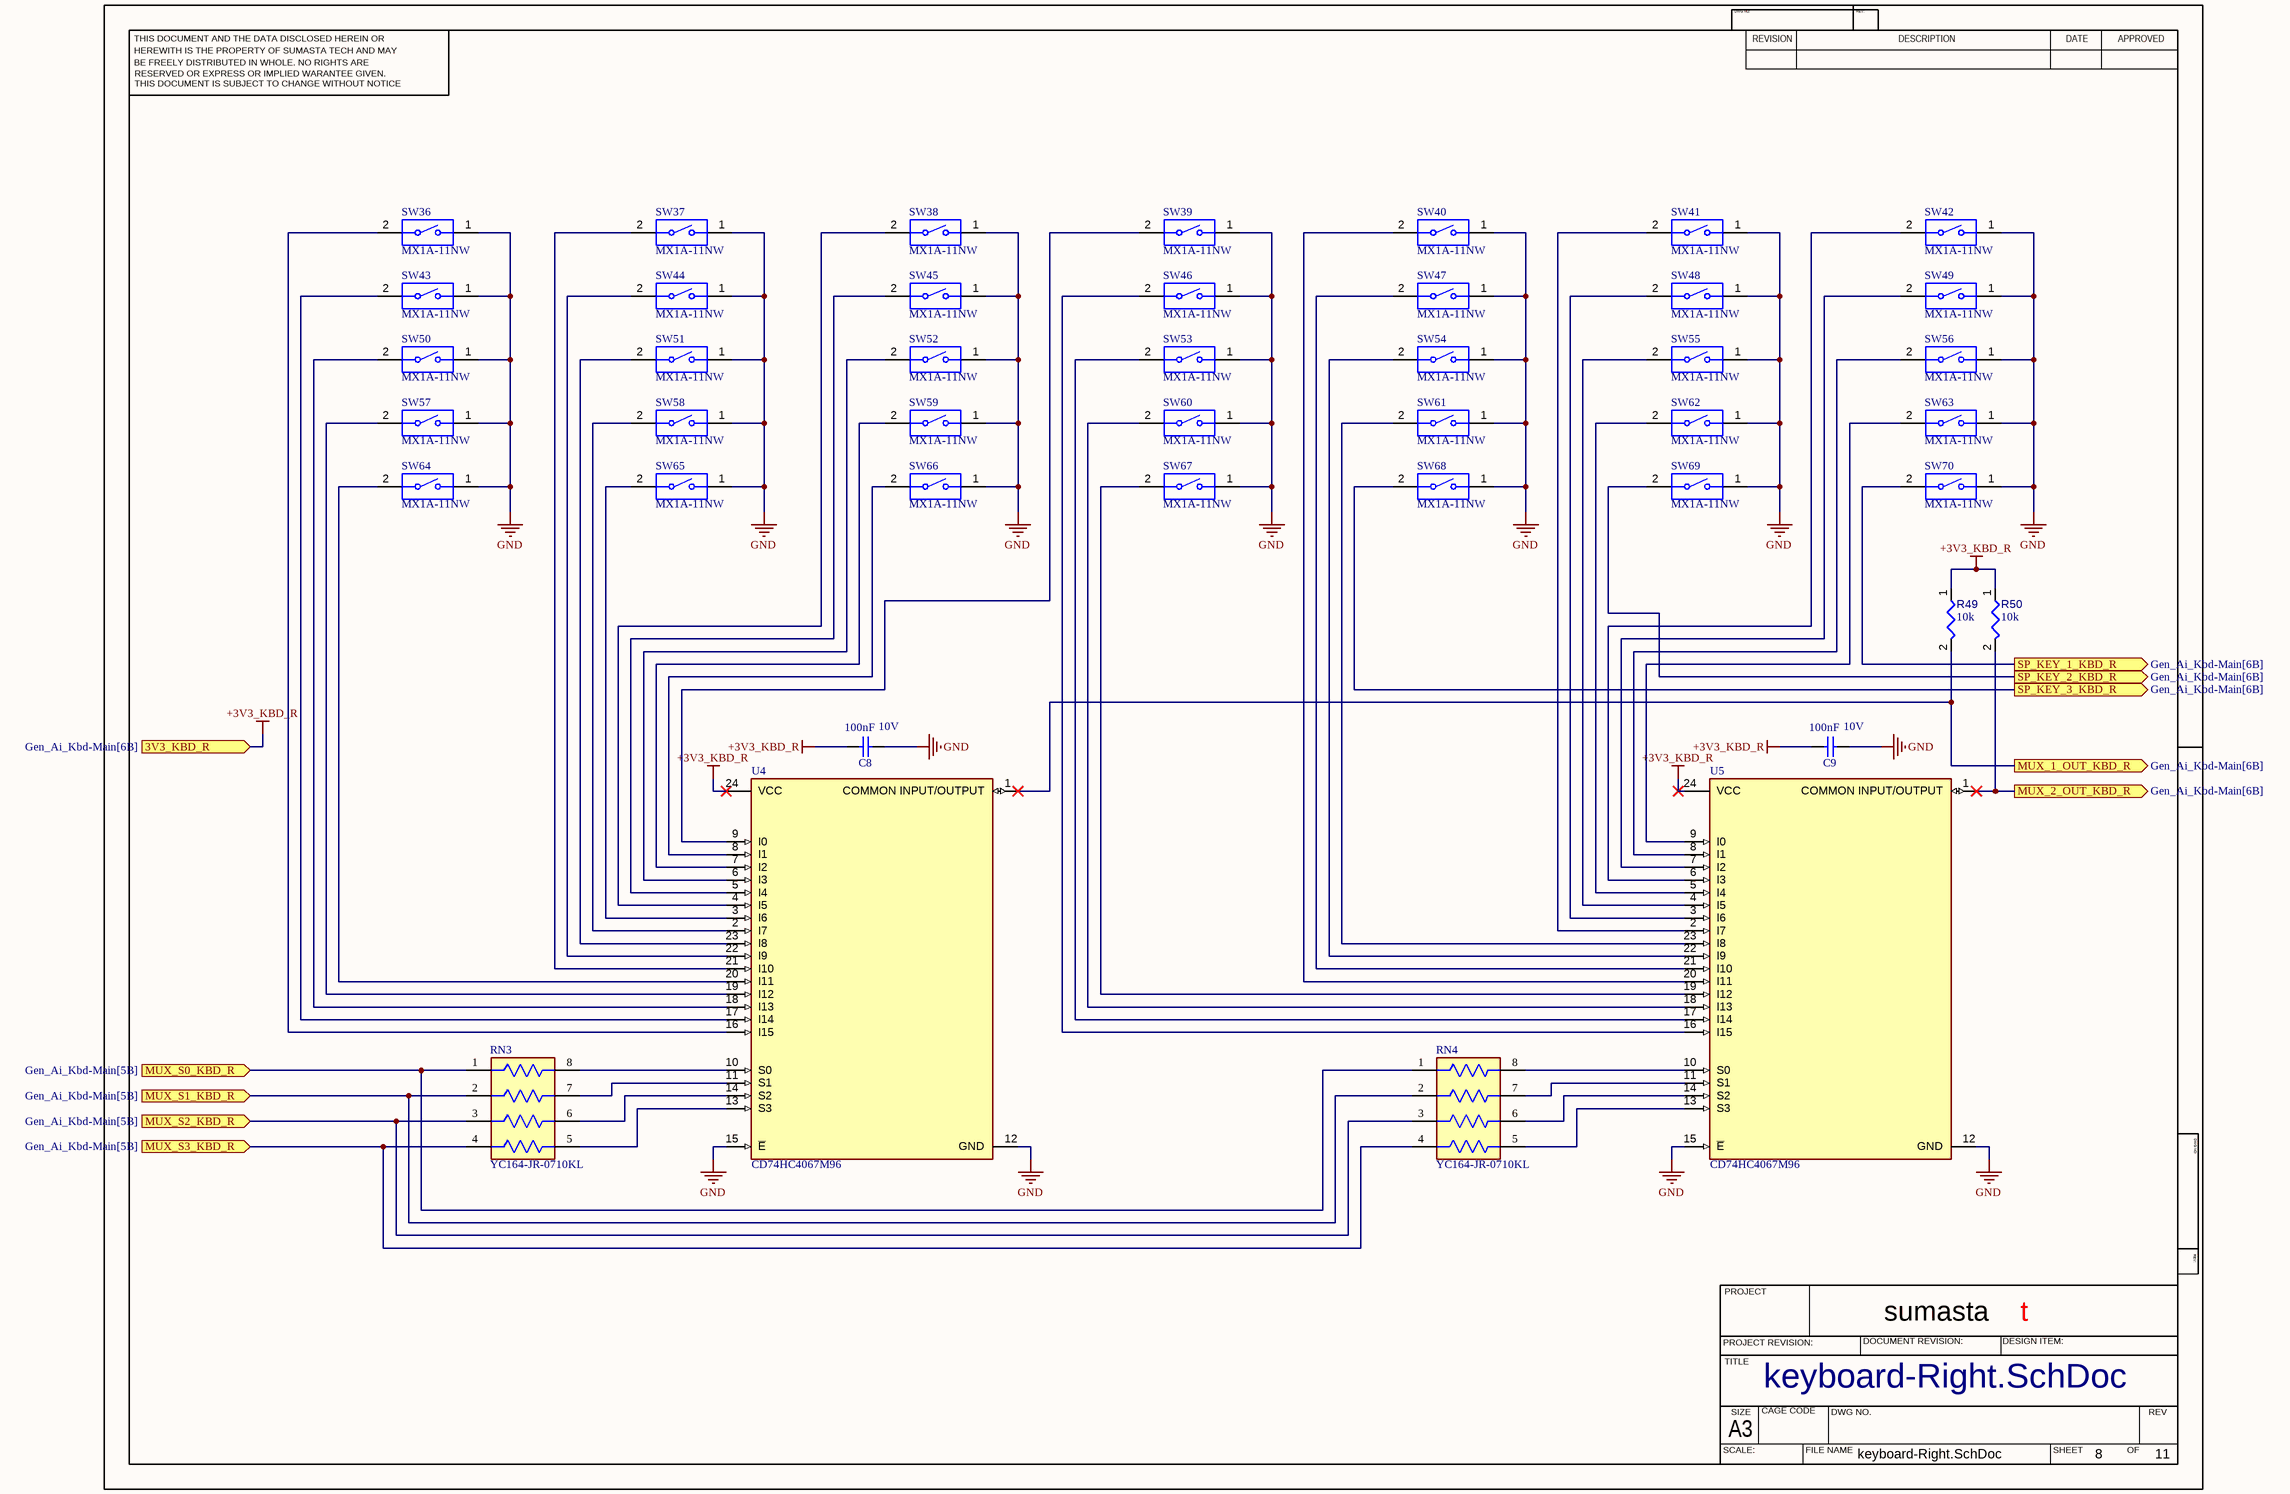
[diagram p2: keyboard-Right.SchDoc]

### Parts
C8  Rated Voltage (DC): 10V  Capacitance: 100nF  [WCAP-CSGP_0603_L1.6W0.8H0.8_Reflow]  (hidden comment: 885012206020)
C9  Rated Voltage (DC): 10V  Capacitance: 100nF  [WCAP-CSGP_0603_L1.6W0.8H0.8_Reflow]  (hidden comment: 885012206020)
R49  value 10k  [RESC1608X55X25ML10T15]  (hidden comment: Resistor 10k +/-1% 0603 100 mW)
R50  value 10k  [RESC1608X55X25ML10T15]  (hidden comment: Resistor 10k +/-1% 0603 100 mW)
RN3  YC164-JR-0710KL  [FP-YC164-MFG]
RN4  YC164-JR-0710KL  [FP-YC164-MFG]
SW36  MX1A-11NW  [CHRY-MX1A-11NW_V]
SW37  MX1A-11NW  [CHRY-MX1A-11NW_V]
SW38  MX1A-11NW  [CHRY-MX1A-11NW_V]
SW39  MX1A-11NW  [CHRY-MX1A-11NW_V]
SW40  MX1A-11NW  [CHRY-MX1A-11NW_V]
SW41  MX1A-11NW  [CHRY-MX1A-11NW_V]
SW42  MX1A-11NW  [CHRY-MX1A-11NW_V]
SW43  MX1A-11NW  [CHRY-MX1A-11NW_V]
SW44  MX1A-11NW  [CHRY-MX1A-11NW_V]
SW45  MX1A-11NW  [CHRY-MX1A-11NW_V]
SW46  MX1A-11NW  [CHRY-MX1A-11NW_V]
SW47  MX1A-11NW  [CHRY-MX1A-11NW_V]
SW48  MX1A-11NW  [CHRY-MX1A-11NW_V]
SW49  MX1A-11NW  [CHRY-MX1A-11NW_V]
SW50  MX1A-11NW  [CHRY-MX1A-11NW_V]
SW51  MX1A-11NW  [CHRY-MX1A-11NW_V]
SW52  MX1A-11NW  [CHRY-MX1A-11NW_V]
SW53  MX1A-11NW  [CHRY-MX1A-11NW_V]
SW54  MX1A-11NW  [CHRY-MX1A-11NW_V]
SW55  MX1A-11NW  [CHRY-MX1A-11NW_V]
SW56  MX1A-11NW  [CHRY-MX1A-11NW_V]
SW57  MX1A-11NW  [CHRY-MX1A-11NW_V]
SW58  MX1A-11NW  [CHRY-MX1A-11NW_V]
SW59  MX1A-11NW  [CHRY-MX1A-11NW_V]
SW60  MX1A-11NW  [CHRY-MX1A-11NW_V]
SW61  MX1A-11NW  [CHRY-MX1A-11NW_V]
SW62  MX1A-11NW  [CHRY-MX1A-11NW_V]
SW63  MX1A-11NW  [CHRY-MX1A-11NW_V]
SW64  MX1A-11NW  [CHRY-MX1A-11NW_V]
SW65  MX1A-11NW  [CHRY-MX1A-11NW_V]
SW66  MX1A-11NW  [CHRY-MX1A-11NW_V]
SW67  MX1A-11NW  [CHRY-MX1A-11NW_V]
SW68  MX1A-11NW  [CHRY-MX1A-11NW_V]
SW69  MX1A-11NW  [CHRY-MX1A-11NW_V]
SW70  MX1A-11NW  [CHRY-MX1A-11NW_V]
U4  CD74HC4067M96  [FP-DW0024A-MFG]
U5  CD74HC4067M96  [FP-DW0024A-MFG]

### Ports
3V3_KBD_R (in, see Gen_Ai_Kbd-Main[6B]), MUX_1_OUT_KBD_R (out, see Gen_Ai_Kbd-Main[6B]), MUX_2_OUT_KBD_R (out, see Gen_Ai_Kbd-Main[6B]), MUX_S0_KBD_R (in, see Gen_Ai_Kbd-Main[5B]), MUX_S1_KBD_R (in, see Gen_Ai_Kbd-Main[5B]), MUX_S2_KBD_R (in, see Gen_Ai_Kbd-Main[5B]), MUX_S3_KBD_R (in, see Gen_Ai_Kbd-Main[5B]), SP_KEY_1_KBD_R (out, see Gen_Ai_Kbd-Main[6B]), SP_KEY_2_KBD_R (out, see Gen_Ai_Kbd-Main[6B]), SP_KEY_3_KBD_R (out, see Gen_Ai_Kbd-Main[6B])

### Nets
+3V3_KBD_R: C8.1 C9.1 R49.1 R50.1 U4.24(VCC) U5.24(VCC) ; port 3V3_KBD_R  [project net +3V3_GLOBAL_BUS]
GND: C8.2 C9.2 SW36.1 SW37.1 SW38.1 SW39.1 SW40.1 SW41.1 SW42.1 SW43.1 SW44.1 SW45.1 SW46.1 SW47.1 SW48.1 SW49.1 SW50.1 SW51.1 SW52.1 SW53.1 SW54.1 SW55.1 SW56.1 SW57.1 SW58.1 SW59.1 SW60.1 SW61.1 SW62.1 SW63.1 SW64.1 SW65.1 SW66.1 SW67.1 SW68.1 SW69.1 SW70.1 U4.12(GND) U4.15(~{E}) U5.12(GND) U5.15(~{E})
PB6: SW70.2 ; port SP_KEY_1_KBD_R
PB11: SW68.2 ; port SP_KEY_3_KBD_R
PC0: R49.2 U4.1(COMMON_INPUT/OUTPUT) ; port MUX_1_OUT_KBD_R
PC4: R50.2 U5.1(COMMON_INPUT/OUTPUT) ; port MUX_2_OUT_KBD_R
PD11: RN3.3 RN4.3 ; port MUX_S2_KBD_R
PD12: RN3.2 RN4.2 ; port MUX_S1_KBD_R
PD13: RN3.1 RN4.1 ; port MUX_S0_KBD_R
PE0: SW69.2 ; port SP_KEY_2_KBD_R
PG0: RN3.4 RN4.4 ; port MUX_S3_KBD_R
NetRN3_5: RN3.5 U4.13(S3)
NetRN3_6: RN3.6 U4.14(S2)
NetRN3_7: RN3.7 U4.11(S1)
NetRN3_8: RN3.8 U4.10(S0)
NetRN4_5: RN4.5 U5.13(S3)
NetRN4_6: RN4.6 U5.14(S2)
NetRN4_7: RN4.7 U5.11(S1)
NetRN4_8: RN4.8 U5.10(S0)
NetSW36_2: SW36.2 U4.16(I15)
NetSW37_2: SW37.2 U4.21(I10)
NetSW38_2: SW38.2 U4.4(I5)
NetSW39_2: SW39.2 U4.9(I0)
NetSW40_2: SW40.2 U5.20(I11)
NetSW41_2: SW41.2 U5.2(I7)
NetSW42_2: SW42.2 U5.6(I3)
NetSW43_2: SW43.2 U4.17(I14)
NetSW44_2: SW44.2 U4.22(I9)
NetSW45_2: SW45.2 U4.5(I4)
NetSW46_2: SW46.2 U5.16(I15)
NetSW47_2: SW47.2 U5.21(I10)
NetSW48_2: SW48.2 U5.3(I6)
NetSW49_2: SW49.2 U5.7(I2)
NetSW50_2: SW50.2 U4.18(I13)
NetSW51_2: SW51.2 U4.23(I8)
NetSW52_2: SW52.2 U4.6(I3)
NetSW53_2: SW53.2 U5.17(I14)
NetSW54_2: SW54.2 U5.22(I9)
NetSW55_2: SW55.2 U5.4(I5)
NetSW56_2: SW56.2 U5.8(I1)
NetSW57_2: SW57.2 U4.19(I12)
NetSW58_2: SW58.2 U4.2(I7)
NetSW59_2: SW59.2 U4.7(I2)
NetSW60_2: SW60.2 U5.18(I13)
NetSW61_2: SW61.2 U5.23(I8)
NetSW62_2: SW62.2 U5.5(I4)
NetSW63_2: SW63.2 U5.9(I0)
NetSW64_2: SW64.2 U4.20(I11)
NetSW65_2: SW65.2 U4.3(I6)
NetSW66_2: SW66.2 U4.8(I1)
NetSW67_2: SW67.2 U5.19(I12)

### Notes on the sheet
- THIS DOCUMENT AND THE DATA DISCLOSED HEREIN OR
- HEREWITH IS THE PROPERTY OF SUMASTA TECH AND MAY
- DWG NO:
- REVISION
- REV:
- DESCRIPTION
- DATE
- APPROVED
- BE FREELY DISTRIBUTED IN WHOLE. NO RIGHTS ARE
- THIS DOCUMENT IS SUBJECT TO CHANGE WITHOUT NOTICE
- RESERVED OR EXPRESS OR IMPLIED WARANTEE GIVEN.
- PROJECT
- sumasta
- t
- PROJECT REVISION:
- TITLE
- DOCUMENT REVISION:
- DESIGN ITEM:
- SCALE:
- A3
- SIZE
- CAGE CODE
- FILE NAME
- DWG NO.
- SHEET
- OF
- REV

### Library data of the parts
C8 C9 = CMP-007-000576-1: as C6 on sheet keyboard-Left; Operating Temperature Min: -55°C; Packaging: Tape and Reel; Manufacturer Part Number: 885012206020; Source: WCAP-CSGP.SchLib; ComponentLink1Description: Website Link; Ceramic Type: X7R; Component Type: Standard; Height: 0.8mm; ComponentLink2URL: https://www.we-online.com/redexpert/spec/885012206020?ad; Mount: Surface Mount; Length: 1.6mm; Pin Count: 2; Design Item ID: 885012206020; ComponentLink1URL: https://www.we-online.com/redexpert/article/885012206020?ad; Width: 0.8mm; Operating Temperature Max: 125°C; Category: Multilayer Ceramic Chip Capacitors; Match Code: WCAP-CSGP; ComponentLink2Description: Datasheet Link
R49 R50 = CMP-009-00017-5: as R47 on sheet keyboard-Left; RoHS Compliant: True; Min Operating Temperature: -55°C; Pins: 2; Case/Package: 0603; Mounting Technology: SM; Max Operating Temperature: 155°C; Tolerance: 1%
RN3 RN4 = CMP-03411-000003-1: as RN1 on sheet keyboard-Left; Depth: 1.6mm; Termination: SMD/SMT; Technology: THICK FILM; Lead Free: Lead Free; Min Operating Temperature: -55°C; Number of Elements: 4; Series: YC164; Radiation Hardening: No; Length: 0.126inch; Width: 0.063inch; Case Code (Metric): 3216; Number of Pins: 8; Package Quantity: 5000; Number of Contacts: 8; Working Voltage: 50V; Packaging: Tape and Reel; Height: 0.028inch; Mount: Surface Mount; Number of Resistors: 4; Case Code (Imperial): 1206; Size Code: 0603; Terminal Pitch: 0.8mm; Military Standard: Not; Power Dissipation: 62.5mW; Case/Package: 0164; RoHS Compliant: Yes; Max Operating Temperature: 155°C
SW36-SW70 = CMP-011-00013-1: as SW1 on sheet keyboard-Left
U4 U5 = CMP-04901-000007-1: as U2 on sheet keyboard-Left; ComponentLink2Description: Datasheet; Octopart: https://octopart.com/cd74hc4067m96-texas+instruments-722802; Ambient Temperature Range High: +125°C; Ipc Land Pattern Name: SOIC127P1030X265-24; Height: 2.65mm; Mouser Description: Multiplexer Switch ICs Hi-Spd CMOS 16Ch Anl Mltplxr/Demltplxr; Temperature Range Low: -55°C; Package: DW0024A; Temperature Range High: +125°C; Lead Free: Yes; ComponentLink2URL: http://www.ti.com/lit/ds/symlink/cd74hc4067.pdf; Manufacturer Part Number: CD74HC4067M96; RoHS: TRUE; Automotive: No; Device Class L1: Integrated Circuits (ICs); Digikey Description: IC MUX/DEMUX 1X16 24SOIC; Device Class L2: Logic ICs; Temperature: -55°C to +125°C; Device Class L3: Multiplexers; Category: IC; Ambient Temperature Range Low: -55°C; Number Of Outputs: 1

## Sheet PoE.SchDoc
size 420 x 297 mm; SPICEModelCacheUYAYKKGT: <root> / <DocumentId>UYAYKKGT</DocumentId> / <CacheFrame Number="0"> / <Model Name="1206_885012008079_10nf" Kind="CKT"> / <Text>******* / .subckt 1206_885012008079_10nF 1 2 / Rser 1 3 0.0235458917441 / Lser 2 4 4.56933086E-10 / C1 3 4 0.00000001 / Rpar 3 4 10000000000 / .ends 1206_885012008079_10nF</Text> / </Model> / <Model Name="0603_885012206114_10nf" Kind="CKT"> / <Text>******* / .subckt 0603_885012206114_10nF 1 2 / Rser 1 3 0.0614305159536 / Lser 2 4 4.58570264E-10 / C1 3 4 0.00000001 / Rpar 3 4 10000000000 / .ends 0603_885012206114_10nF</Text> / </Model> / <Model Name="0603_885012206095_100nf" Kind="CKT"> / <Text>******* / .subckt 0603_885012206095_100nF 1 2 / Rser 1 3 0.0157659152881 / Lser 2 4 3.10171966E-10 / C1 3 4 0.0000001 / Rpar 3 4 5000000000 / .ends 0603_885012206095_100nF</Text> / </Model> / <Model Name="0603_885012106006_10uf" Kind="CKT"> / <Text>******* / .subckt 0603_885012106006_10uF 1 2 / Rser 1 3 0.00407641026021 / Lser 2 4 4.16060333E-10 / C1 3 4 0.00001 / Rpar 3 4 5000000 / .ends 0603_885012106006_10uF</Text> / </Model> / <Model Name="1806_74279246_1000ohm" Kind="CKT"> / <Text>******* / .subckt 1806_74279246_1000ohm 1 2 / Rp 1 2 1045 / Cp 1 2 1.241p / Rs 1 N3 0.056 / L1 N3 2 3.003u / .ends 1806_74279246_1000ohm</Text> / </Model> / </CacheFrame> / </root>; SheetNumber: 7; SheetTotal: 11
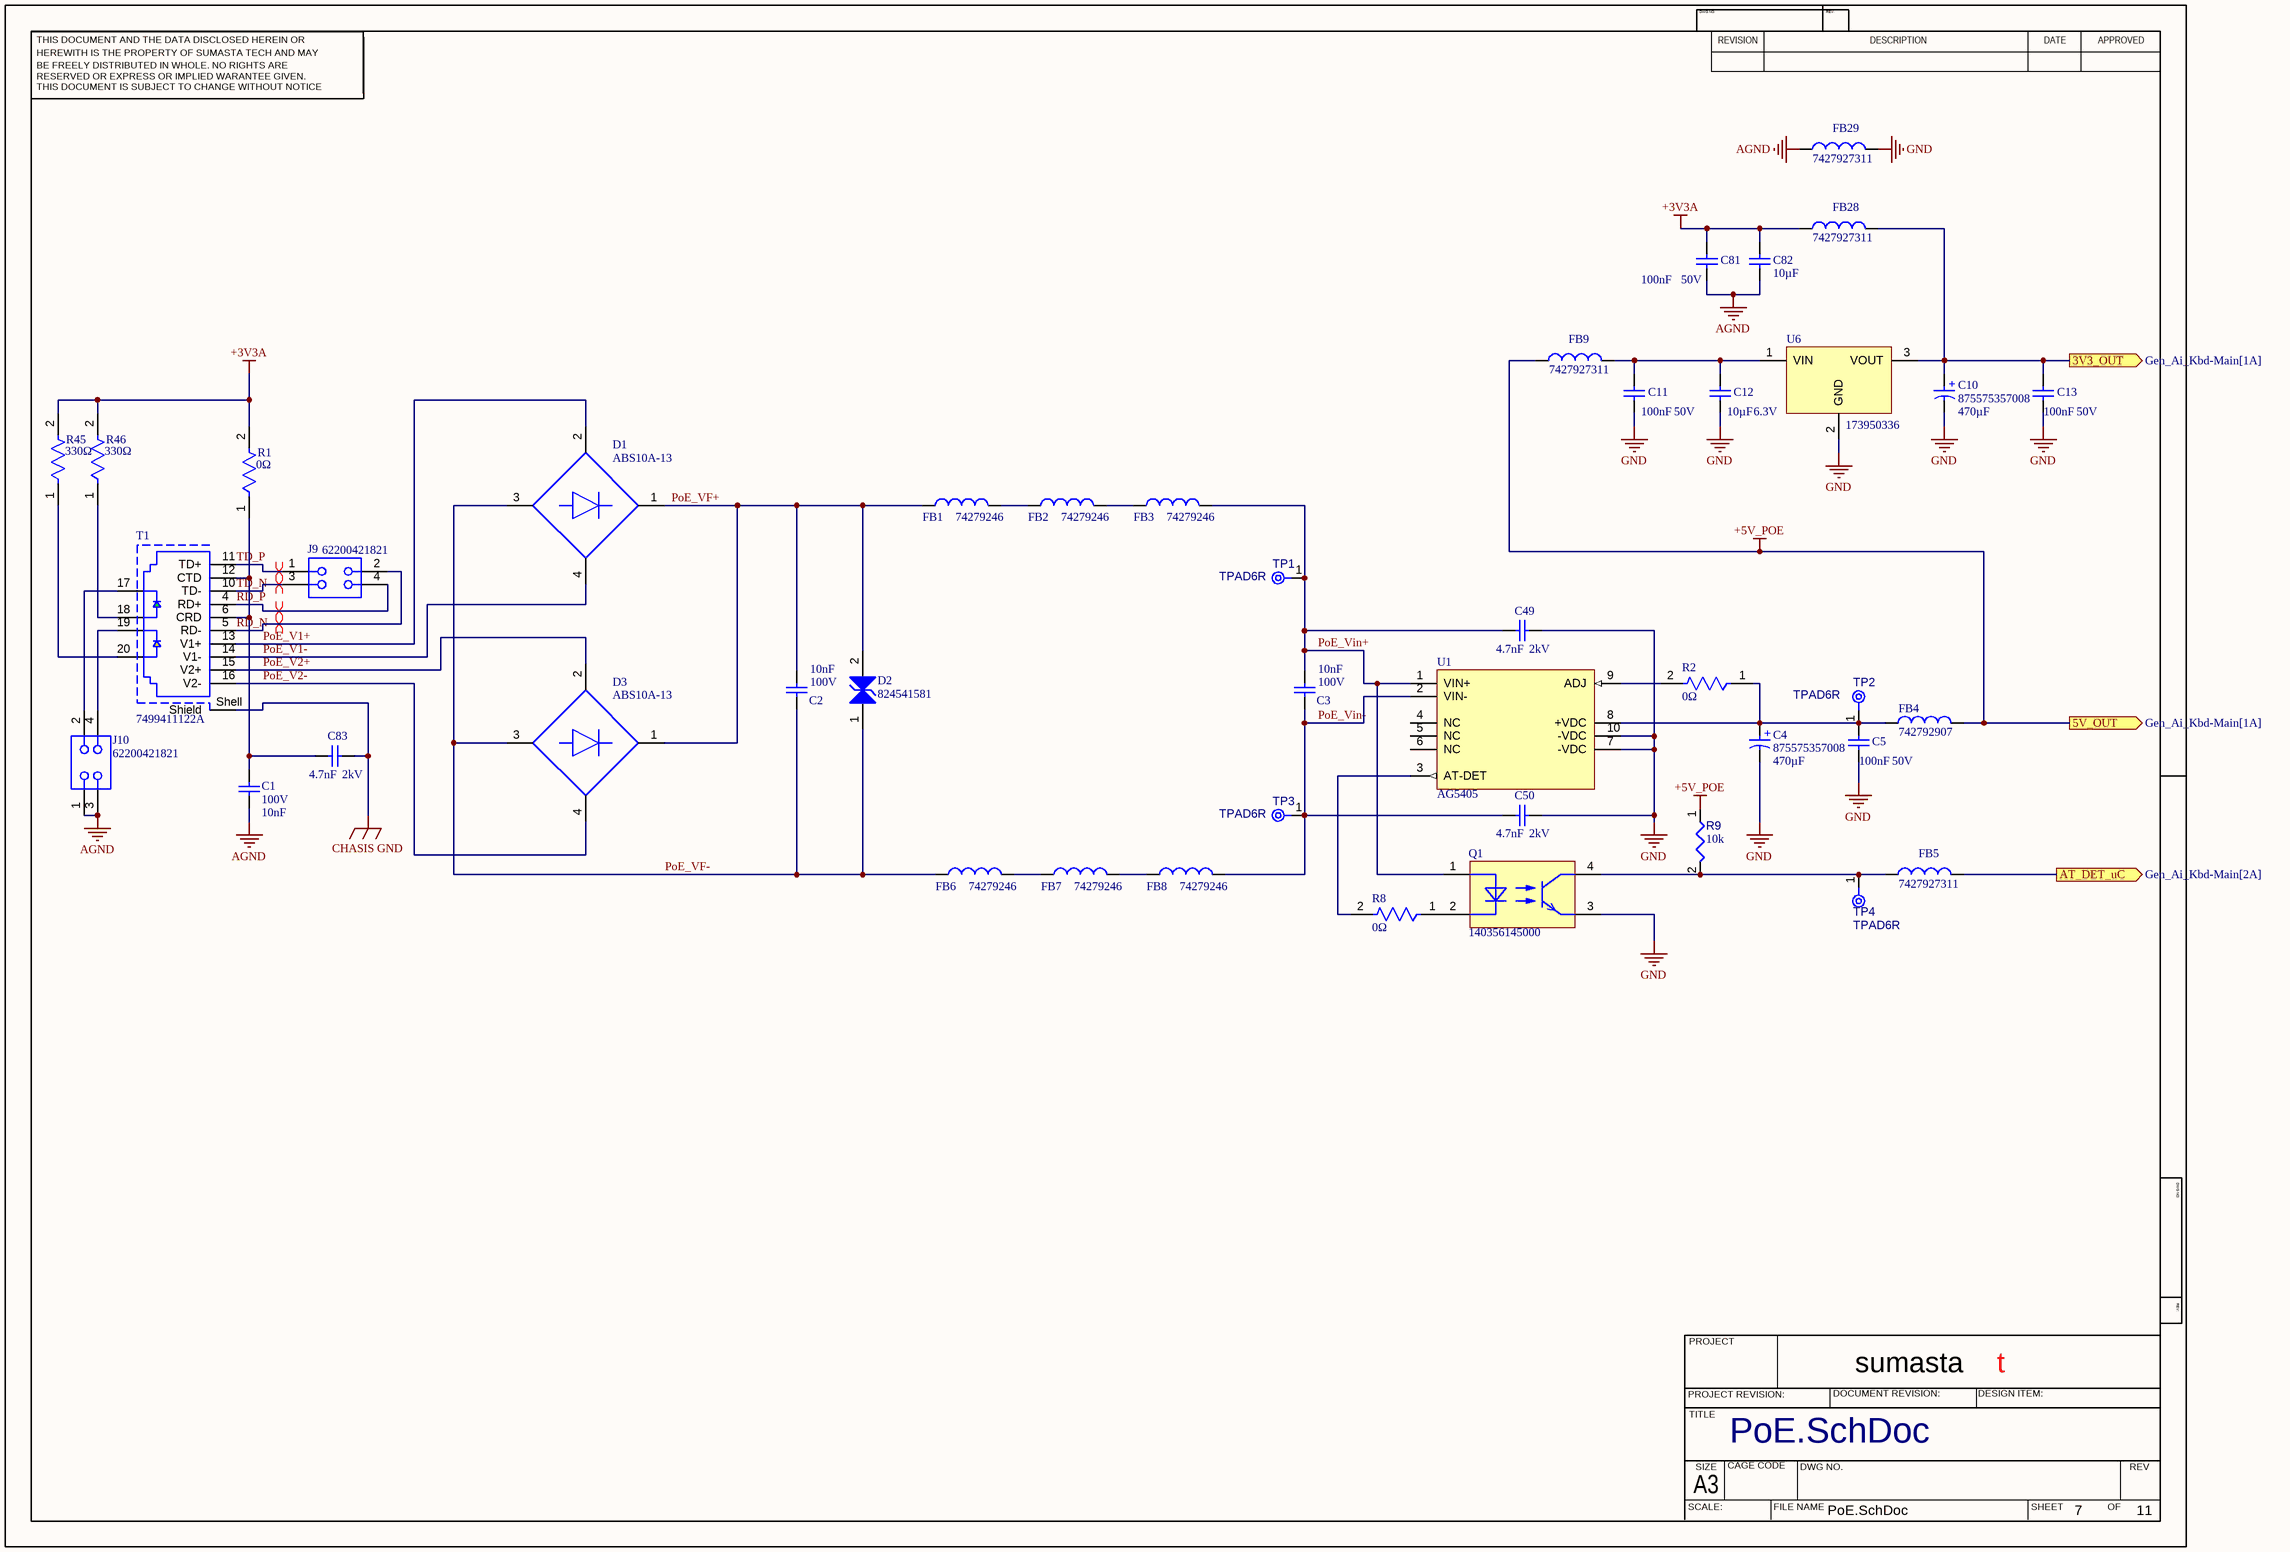
[diagram p3: PoE.SchDoc]

### Parts
C1  Rated Voltage (DC): 100V  Capacitance: 10nF  [WCAP-CSGP_0603_L1.6W0.8H0.8_Reflow]  (hidden comment: 885012206114)
C2  Rated Voltage (DC): 100V  Capacitance: 10nF  [WCAP-CSGP_1206_L3.2W1.6H1.25]  (hidden comment: 885012008079)
C3  Rated Voltage (DC): 100V  Capacitance: 10nF  [WCAP-CSGP_1206_L3.2W1.6H1.25]  (hidden comment: 885012008079)
C4  875575357008  Capacitance: 470µF  [WCAP-HSG5_D10H10.5]
C5  Capacitance: 100nF  Rated Voltage (DC): 50V  [WCAP-CSGP_0603_L1.6W0.8H0.8_Reflow]  (hidden comment: 885012206095)
C10  875575357008  Capacitance: 470µF  [WCAP-HSG5_D10H10.5]
C11  Capacitance: 100nF  Rated Voltage (DC): 50V  [WCAP-CSGP_0603_L1.6W0.8H0.8_Reflow]  (hidden comment: 885012206095)
C12  Rated Voltage (DC): 6.3V  Capacitance: 10µF  [WCAP-CSGP_0603_L1.6W0.8H0.8_Reflow]  (hidden comment: 885012106006)
C13  Capacitance: 100nF  Rated Voltage (DC): 50V  [WCAP-CSGP_0603_L1.6W0.8H0.8_Reflow]  (hidden comment: 885012206095)
C49  Voltage Rating (DC): 2kV  Capacitance: 4.7nF  [WCAP-CSMH_1812_L4.5W3.2H2]  (hidden comment: 885342211008)
C50  Voltage Rating (DC): 2kV  Capacitance: 4.7nF  [WCAP-CSMH_1812_L4.5W3.2H2]  (hidden comment: 885342211008)
C81  Capacitance: 100nF  Rated Voltage (DC): 50V  [WCAP-CSGP_0603_L1.6W0.8H0.8_Reflow]  (hidden comment: 885012206095)
C82  Capacitance: 10µF  [WCAP-CSGP_0603_L1.6W0.8H0.8_Reflow]  (hidden comment: 885012106006)
C83  Voltage Rating (DC): 2kV  Capacitance: 4.7nF  [WCAP-CSMH_1812_L4.5W3.2H2]  (hidden comment: 885342211008)
D1  ABS10A-13  [FP-SOPA-4-MFG]
D2  824541581  [WE-TVSP_DO-214AB_Bidirectional]
D3  ABS10A-13  [FP-SOPA-4-MFG]
FB1  74279246  [WE-CBF_1806_L4.5W1.6H1.6_HS/WB]
FB2  74279246  [WE-CBF_1806_L4.5W1.6H1.6_HS/WB]
FB3  74279246  [WE-CBF_1806_L4.5W1.6H1.6_HS/WB]
FB4  742792907  [WE-PF_1280]
FB5  7427927311  [WE-CBF_0402_L1W0.5H0.5_HC]
FB6  74279246  [WE-CBF_1806_L4.5W1.6H1.6_HS/WB]
FB7  74279246  [WE-CBF_1806_L4.5W1.6H1.6_HS/WB]
FB8  74279246  [WE-CBF_1806_L4.5W1.6H1.6_HS/WB]
FB9  7427927311  [WE-CBF_0402_L1W0.5H0.5_HC]
FB28  7427927311  [WE-CBF_0402_L1W0.5H0.5_HC]
FB29  7427927311  [WE-CBF_0402_L1W0.5H0.5_HC]
J9  62200421821  [62200421821]
J10  62200421821  [62200421821]
Q1  140356145000  [WL-OCPT_SOP4]
R1  value 0Ω  [FP-RC0603-MFG]  (hidden comment: RC0603FR-070RL)
R2  value 0Ω  [FP-RC0603-MFG]  (hidden comment: RC0603FR-070RL)
R8  value 0Ω  [FP-RC0603-MFG]  (hidden comment: RC0603FR-070RL)
R9  value 10k  [RESC1608X55X25ML10T15]  (hidden comment: Resistor 10k +/-1% 0603 100 mW)
R45  value 330Ω  [FP-RC0603-MFG]  (hidden comment: RC0603FR-070RL)
R46  value 330Ω  [FP-RC0603-MFG]  (hidden comment: RC0603FR-070RL)
T1  7499411122A  [7499411122A]
TP1  TPAD6R  [TP06R]  (no BOM)
TP2  TPAD6R  [TP06R]  (no BOM)
TP3  TPAD6R  [TP06R]  (no BOM)
TP4  TPAD6R  [TP06R]  (no BOM)
U1  AG5405  [AG540X]
U6  173950336  [WPME-FDSM_SIP-3_L11.6W7.55H10.16]

### Ports
3V3_OUT (out, see Gen_Ai_Kbd-Main[1A]), 5V_OUT (out, see Gen_Ai_Kbd-Main[1A]), AT_DET_uC (out, see Gen_Ai_Kbd-Main[2A])

### Nets
+3V3_GLOBAL_BUS: C10.1(P) C13.2 FB28.2 U6.3(VOUT) ; port 3V3_OUT
+3V3A: C81.2 C82.2 FB28.1 R1.2 R45.2 R46.2
+5V_POE: FB4.2 FB9.1 R9.1 ; port 5V_OUT  [project net +5V_GLOBAL_BUS]
AGND: C1.2 C81.1 C82.1 FB29.1 J10.1 J10.3
CHASIS GND: C83.2 T1.Shell(Shield)
GND: C4.2(N) C5.1 C10.2(N) C11.1 C12.1 C13.1 C49.2 C50.2 FB29.2 Q1.3(Emitter) U1.7(-VDC) U1.10(-VDC) U6.2(GND)
PF7: FB5.2 ; port AT_DET_uC
PoE_V1+: D1.2(1_~) T1.13(V1+)
PoE_V1-: D1.4(2_~) T1.14(V1-)
PoE_V2+: D3.2(1_~) T1.15(V2+)
PoE_V2-: D3.4(2_~) T1.16(V2-)
PoE_VF+: C2.2 D1.1(+) D2.2 D3.1(+) FB1.1
PoE_VF-: C2.1 D1.3(-) D2.1 D3.3(-) FB6.1
PoE_Vin+: C3.2 C49.1 FB3.2 Q1.1(Anode) TP1.1(TP) U1.1(VIN+)
PoE_Vin-: C3.1 C50.1 FB8.2 TP3.1(TP) U1.2(VIN-)
RD_N: J9.2 T1.5(RD-)
RD_P: J9.4 T1.4(RD+)
TD_N: J9.3 T1.10(TD-)
TD_P: J9.1 T1.11(TD+)
NetC1_1: C1.1 C83.1 R1.1 T1.6(CRD) T1.12(CTD)
NetC4_1: C4.1(P) C5.2 FB4.1 R2.1 TP2.1(TP) U1.8(+VDC)
NetC11_2: C11.2 C12.2 FB9.2 U6.1(VIN)
NetFB1_2: FB1.2 FB2.1
NetFB2_2: FB2.2 FB3.1
NetFB5_1: FB5.1 Q1.4(Collector) R9.2 TP4.1(TP)
NetFB6_2: FB6.2 FB7.1
NetFB7_2: FB7.2 FB8.1
NetJ10_2: J10.2 T1.17
NetJ10_4: J10.4 T1.19
NetQ1_2: Q1.2(Cathode) R8.1
NetR2_2: R2.2 U1.9(ADJ)
NetR8_2: R8.2 U1.3(AT-DET)
NetR45_1: R45.1 T1.20
NetR46_1: R46.1 T1.18

Not connected (* = marked no-connect by the designer): U1 4(NC) 5(NC) 6(NC)

### Layout directives
differential pair: RD_N, RD_P, TD_N, TD_P

### Notes on the sheet
- THIS DOCUMENT AND THE DATA DISCLOSED HEREIN OR
- HEREWITH IS THE PROPERTY OF SUMASTA TECH AND MAY
- DWG NO:
- REVISION
- REV:
- DESCRIPTION
- DATE
- APPROVED
- BE FREELY DISTRIBUTED IN WHOLE. NO RIGHTS ARE
- THIS DOCUMENT IS SUBJECT TO CHANGE WITHOUT NOTICE
- RESERVED OR EXPRESS OR IMPLIED WARANTEE GIVEN.
- PROJECT
- sumasta
- t
- PROJECT REVISION:
- TITLE
- DOCUMENT REVISION:
- DESIGN ITEM:
- SCALE:
- A3
- SIZE
- CAGE CODE
- FILE NAME
- DWG NO.
- SHEET
- OF
- REV
- (in symbol CMP-03913-134709151-1) +

### Library data of the parts
C1 = CMP-007-000667-1: WCAP-CSGP Multilayer Ceramic Chip Capacitor, General Purpose, size 0603, X7R, 10nF, 100VDC; Manufacturer: Wurth Elektronik; Technical Reference: X7R0603103K100DFCT10000; Insulation Resistance: 10GO; Dissipation Factor: 2.5%; Case/Size Code: 0603; Capacitance Tolerance: +/-10%; Width: 0.8mm; ComponentLink2URL: https://www.we-online.com/redexpert/spec/885012206114?ad; Packaging: Tape and Reel; Match Code: WCAP-CSGP; Source: WCAP-CSGP.SchLib; Mount: Surface Mount; Design Item ID: 885012206114; Category: Multilayer Ceramic Chip Capacitors; Manufacturer Part Number: 885012206114; Operating Temperature Max: 125°C; Operating Temperature Min: -55°C; Pin Count: 2; Height: 0.8mm; ComponentLink1URL: https://www.we-online.com/redexpert/article/885012206114?ad; ComponentLink2Description: Datasheet Link; Component Type: Standard; ComponentLink1Description: Website Link; Ceramic Type: X7R; Length: 1.6mm
C2 C3 = CMP-007-000324-1: WCAP-CSGP Multilayer Ceramic Chip Capacitor, General Purpose, size 1206, NP0, 10nF, 100VDC; Manufacturer: Wurth Elektronik; Technical Reference: NP01206103J100DFCT10000; Q Factor: 1000; Insulation Resistance: 10GO; Capacitance Tolerance: +/-5%; Case/Size Code: 1206; ComponentLink2URL: https://www.we-online.com/redexpert/spec/885012008079?ad; Packaging: Tape and Reel; Source: WCAP-CSGP.SchLib; Width: 1.6mm; Pin Count: 2; Match Code: WCAP-CSGP; Length: 3.2mm; ComponentLink1URL: https://www.we-online.com/redexpert/article/885012008079?ad; Ceramic Type: NP0; Mount: Surface Mount; ComponentLink2Description: Datasheet Link; Manufacturer Part Number: 885012008079; Operating Temperature Max: 125°C; Height: 1.25mm; ComponentLink1Description: Website Link; Design Item ID: 885012008079; Component Type: Standard; Category: Multilayer Ceramic Chip Capacitors; Operating Temperature Min: -55°C
C4 C10 = CMP-03913-134709151-1: 875575357008 Cap, 470Uf, 16V, Alu Elec, Hybrid, Smd Rohs Compliant: Yes; ESR (Equivalent Series Resistance): 20mΩ; Leakage Current: 75.2µA; Ripple Current: 2.5A; Min Operating Temperature: -55°C; RoHS: Compliant; Width: 10.3mm; Voltage Rating: 16V; Max Operating Temperature: 105°C; NexarPartId: 134709151; Length: 10.5mm; Diameter: 10mm
C5 C11 C13 C81 = CMP-007-000655-1: WCAP-CSGP Multilayer Ceramic Chip Capacitor, General Purpose, size 0603, X7R, 100nF, 50VDC; Manufacturer: Wurth Elektronik; Capacitance Tolerance: +/-10%; Insulation Resistance: 5GO; Case/Size Code: 0603; Technical Reference: X7R0603104K050DFCT10000; Dissipation Factor: 3%; Operating Temperature Max: 125°C; Category: Multilayer Ceramic Chip Capacitors; ComponentLink1Description: Website Link; Manufacturer Part Number: 885012206095; Pin Count: 2; Ceramic Type: X7R; Component Type: Standard; Mount: Surface Mount; Operating Temperature Min: -55°C; Source: WCAP-CSGP.SchLib; ComponentLink2URL: https://www.we-online.com/redexpert/spec/885012206095?ad; Packaging: Tape and Reel; Match Code: WCAP-CSGP; Width: 0.8mm; ComponentLink1URL: https://www.we-online.com/redexpert/article/885012206095?ad; Height: 0.8mm; Design Item ID: 885012206095; Length: 1.6mm; ComponentLink2Description: Datasheet Link
C12 = CMP-007-000403-1: WCAP-CSGP Multilayer Ceramic Chip Capacitor, General Purpose, size 0603, X5R, 10µF, 6.3VDC; Manufacturer: Wurth Elektronik; Insulation Resistance: 0.01GO; Technical Reference: X5R0603106M6R3DFCT10000; Dissipation Factor: 10%; Case/Size Code: 0603; Capacitance Tolerance: +/-20%; Mount: Surface Mount; Packaging: Tape and Reel; ComponentLink1URL: https://www.we-online.com/redexpert/article/885012106006?ad; Height: 0.8mm; ComponentLink2URL: https://www.we-online.com/redexpert/spec/885012106006?ad; Category: Multilayer Ceramic Chip Capacitors; Operating Temperature Max: 85°C; Operating Temperature Min: -55°C; Source: WCAP-CSGP.SchLib; Match Code: WCAP-CSGP; Design Item ID: 885012106006; Ceramic Type: X5R; Manufacturer Part Number: 885012106006; Component Type: Standard; Pin Count: 2; Width: 0.8mm; ComponentLink2Description: Datasheet Link; ComponentLink1Description: Website Link; Length: 1.6mm
C49 C50 C83 = CMP-03913-89205791-1: 885342211008 4700PF 2000V X7R 1812 10% - Multilayer Ceramic Capacitors; Insulation Resistance: 10GΩ; RoHS: Compliant; Length: 4.5mm; Min Operating Temperature: -55°C; Dielectric: X7R; Width: 3.2mm; NexarPartId: 89205791; Max Operating Temperature: 125°C; Height: 2mm; Voltage Rating: 2kV
C82 = CMP-007-000403-1: WCAP-CSGP Multilayer Ceramic Chip Capacitor, General Purpose, size 0603, X5R, 10µF, 6.3VDC; Manufacturer: Wurth Elektronik; Rated Voltage (DC): 6.3V; Insulation Resistance: 0.01GO; Technical Reference: X5R0603106M6R3DFCT10000; Dissipation Factor: 10%; Case/Size Code: 0603; Capacitance Tolerance: +/-20%; Mount: Surface Mount; Packaging: Tape and Reel; ComponentLink1URL: https://www.we-online.com/redexpert/article/885012106006?ad; Height: 0.8mm; ComponentLink2URL: https://www.we-online.com/redexpert/spec/885012106006?ad; Category: Multilayer Ceramic Chip Capacitors; Operating Temperature Max: 85°C; Operating Temperature Min: -55°C; Source: WCAP-CSGP.SchLib; Match Code: WCAP-CSGP; Design Item ID: 885012106006; Ceramic Type: X5R; Manufacturer Part Number: 885012106006; Component Type: Standard; Pin Count: 2; Width: 0.8mm; ComponentLink2Description: Datasheet Link; ComponentLink1Description: Website Link; Length: 1.6mm
D1 D3 = CMP-12791-000054-1: BRIDGE RECT 1PHASE 1KV 1A 4SOPA; Min Operating Temperature: -55°C; Max Operating Temperature: 150°C; Case/Package: SMD/SMT; Average Rectified Current: 1A; Mount: Surface Mount; Packaging: Cut Tape
D2 = CMP-03913-71101705-1: 824541581 TVS diode [Würth Elektronik] 824541581 TVS diode; Max Breakdown Voltage: 67.8V; Leakage Current: 1µA; Number of Bidirectional Channels: 1; Polarity: Bidirectional; Peak Pulse Power: 1.5kW; Peak Pulse Current: 16.1A; Power Line Protection: No; Reverse Standoff Voltage: 58V; Clamping Voltage: 93.6V; Max Operating Temperature: 150°C; REACH SVHC: Unknown; Height: 2.5mm; Min Operating Temperature: -65°C; Min Breakdown Voltage: 67.8V; Number of Pins: 2; Length: 6.86mm; Composition: Zener; NexarPartId: 71101705; Mount: Surface Mount; RoHS: Compliant; Packaging: Cut Tape; Breakdown Voltage: 67.8V; Width: 5.91mm
FB1-FB3 FB6-FB8 = CMP-021-000088-1: WE-CBF SMT EMI Suppression Ferrite Bead, size 1806, 1000Ohm, 1.5A; Manufacturer: Wurth Elektronik; Impedance Max Test Condition: 85MHz; Case/Size Code: 1806; DC Resistance Max: 0.09Ohm; Impedance Max: 1045Ohm; Type: Wide Band; ComponentLink2URL: https://www.we-online.com/redexpert/spec/74279246?ad; Impedance @100MHz: 1000Ohm; ComponentLink2Description: Datasheet Link; Design Item ID: 74279246; Category: Ferrites for PCB Assembly; ComponentLink1Description: Website Link; Length: 4.5mm; Height: 1.6mm; Manufacturer Part Number: 74279246; Packaging: Tape and Reel; Operating Temperature Min: -55°C; Component Type: Standard; Source: WE-CBF.SchLib; Pin Count: 2; Operating Temperature Max: 125°C; Width: 1.6mm; Mount: Surface Mount; Rated Current: 1.5A; ComponentLink1URL: https://www.we-online.com/redexpert/article/74279246?ad; Match Code: WE-CBF
FB4 = CMP-0220-00071-2: NexarPartId: 21911586; Current Rating: 6A; Tolerance: 25%; Number of Lines: 1; Test Frequency: 100MHz; Impedance: 7.5kΩ; DC Resistance (DCR): 20mΩ; Packaging: Cut Tape; REACH SVHC: Unknown; Max Current Rating: 6A; Case/Package: SMD/SMT; Mount: Surface Mount; Max DC Current: 6A; Length: 12mm; Width: 12mm; Termination: SMD/SMT; Min Operating Temperature: -40°C; Max Operating Temperature: 125°C; RoHS: Compliant; Height: 8mm
FB5 FB9 FB28 FB29 = CMP-0220-00132-2: NexarPartId: 19122429; Max Current Rating: 1.2A; Impedance: 120Ω; Number of Lines: 1; Tolerance: 25%; DC Resistance (DCR): 90mΩ; Test Frequency: 100MHz; Height: 500µm; Material: Ferrite; Width: 500µm; Mount: Surface Mount; Case/Package: SMD/SMT; Max Operating Temperature: 125°C; Current Rating: 1.2A; Case Code (Imperial): 0402; RoHS: Compliant; REACH SVHC: Unknown; Depth: 500µm; Max DC Current: 1.2A; Case Code (Metric): 1005; Length: 1mm; Termination: SMD/SMT; Packaging: Digi-Reel®; Lead Free: Lead Free; Min Operating Temperature: -55°C
J9 J10 = CMP-1502-01179-2: NexarPartId: 65162209; Contact Resistance: 20mΩ; Gender: Female; Current Rating: 1A; Operating Supply Voltage: 250V; Lead Pitch: 1.27mm; Contact Material: Copper; RoHS: Non-Compliant; Number of Pins: 4; Orientation: Vertical
Q1 = CMP-03913-114060666-1: 140356145000 Optocoupler, Transistor, 80V, Sop-4 Rohs Compliant: Yes; Forward Voltage: 1.24V; Max Reverse Voltage (DC): 6V; Forward Current: 60mA; Isolation Voltage: 3.75kV; Width: 3.6mm; RoHS: Compliant; NexarPartId: 114060666; Length: 4.4mm; Min Operating Temperature: -55°C; Max Operating Temperature: 110°C; Height: 2mm
R1 R2 R8 = CMP-2000-06925-2: RES SMD 0 OHM JUMPER 1/10W 0603; Manufacturer: Yageo; Tolerance: 1%; Power Rating: 0.1W; Voltage Rating: 75V; Composition: Thick Film; Temperature Range Low: -55°C; Ipc Land Pattern Name: RESC16080X45; Lead Free: Yes; Digikey Description: RES SMD 0 OHM JUMPER 1/10W 0603; Height: 0.55mm; Automotive: No; Device Class L3: Chip SMD Resistors; Device Class L1: Passive Components; Device Class L2: Resistors; Footprint Url: http://www.yageo.com/exep/pages/download/literatures/PYu-R_Mount_10.pdf; Category: Res; Mouser Description: RC Series 0603 0.1 W 0 O Jumper Surface Mount Thick Film Chip Resistor; Resistance: 0Ω; ComponentLink2URL: http://www.yageo.com/documents/recent/PYu-RC_Group_51_RoHS_L_10.pdf; Series: RC_L; ComponentLink2Description: Datasheet; RoHS: TRUE; Temperature: -55°C to +155°C; Temperature Range High: +155°C; Package: RC0603; Octopart: https://octopart.com/rc0603fr-070rl-yageo-1180803; Manufacturer Part Number: RC0603FR-070RL
R9 = CMP-009-00017-5: as R47 on sheet keyboard-Left; RoHS Compliant: True; Min Operating Temperature: -55°C; Pins: 2; Case/Package: 0603; Mounting Technology: SM; Max Operating Temperature: 155°C; Tolerance: 1%
R45 R46 = CMP-2000-06925-2: RES SMD 0 OHM JUMPER 1/10W 0603; Manufacturer: Yageo; Tolerance: 1%; Power Rating: 0.1W; Voltage Rating: 75V; Resistance: 0Ω; Composition: Thick Film; Temperature Range Low: -55°C; Ipc Land Pattern Name: RESC16080X45; Lead Free: Yes; Digikey Description: RES SMD 0 OHM JUMPER 1/10W 0603; Height: 0.55mm; Automotive: No; Device Class L3: Chip SMD Resistors; Device Class L1: Passive Components; Device Class L2: Resistors; Footprint Url: http://www.yageo.com/exep/pages/download/literatures/PYu-R_Mount_10.pdf; Category: Res; Mouser Description: RC Series 0603 0.1 W 0 O Jumper Surface Mount Thick Film Chip Resistor; ComponentLink2URL: http://www.yageo.com/documents/recent/PYu-RC_Group_51_RoHS_L_10.pdf; Series: RC_L; ComponentLink2Description: Datasheet; RoHS: TRUE; Temperature: -55°C to +155°C; Temperature Range High: +155°C; Package: RC0603; Octopart: https://octopart.com/rc0603fr-070rl-yageo-1180803; Manufacturer Part Number: RC0603FR-070RL
T1 = CMP-03913-82944263-1: 7499411122A Rj45 Conn, R/A Jack, 8P8C, 1Port, Th Rohs Compliant: Yes; Color: Silver; Connector Type: Socket; Insertion Loss (dB): -1dB; Inductance: 350µH; Contact Material: Gold; Width: 17mm; RoHS: Compliant; Case/Package: Metal; Min Operating Temperature: 0°C; Height: 13.87mm; Max Operating Temperature: 70°C; NexarPartId: 82944263; Length: 33.02mm
TP1-TP4 = CMP-00028-00002-2: 0.6mm round; Pins: 1
U1 = CMP-019-00052-1: PoE Module 802.3at
U6 = CMP-03913-104891430-1: 173950336 WPME-FDSM Fixed Step Down Regulator Module; Output Current: 500mA; Max Switching Frequency: 520kHz; Min Input Voltage: 4.75V; Max Input Voltage: 36V; Max Output Voltage: 3.3V; Min Operating Temperature: -40°C; Height: 10.16mm; Ambient Temperature Range Low: -40°C; NexarPartId: 104891430; Max Operating Temperature: 125°C; Length: 11.6mm; Width: 7.55mm; Ambient Temperature Range High: 85°C; RoHS: Compliant